# EAGLE board EPS (EAGLE 9.5.1), part 1 of 3
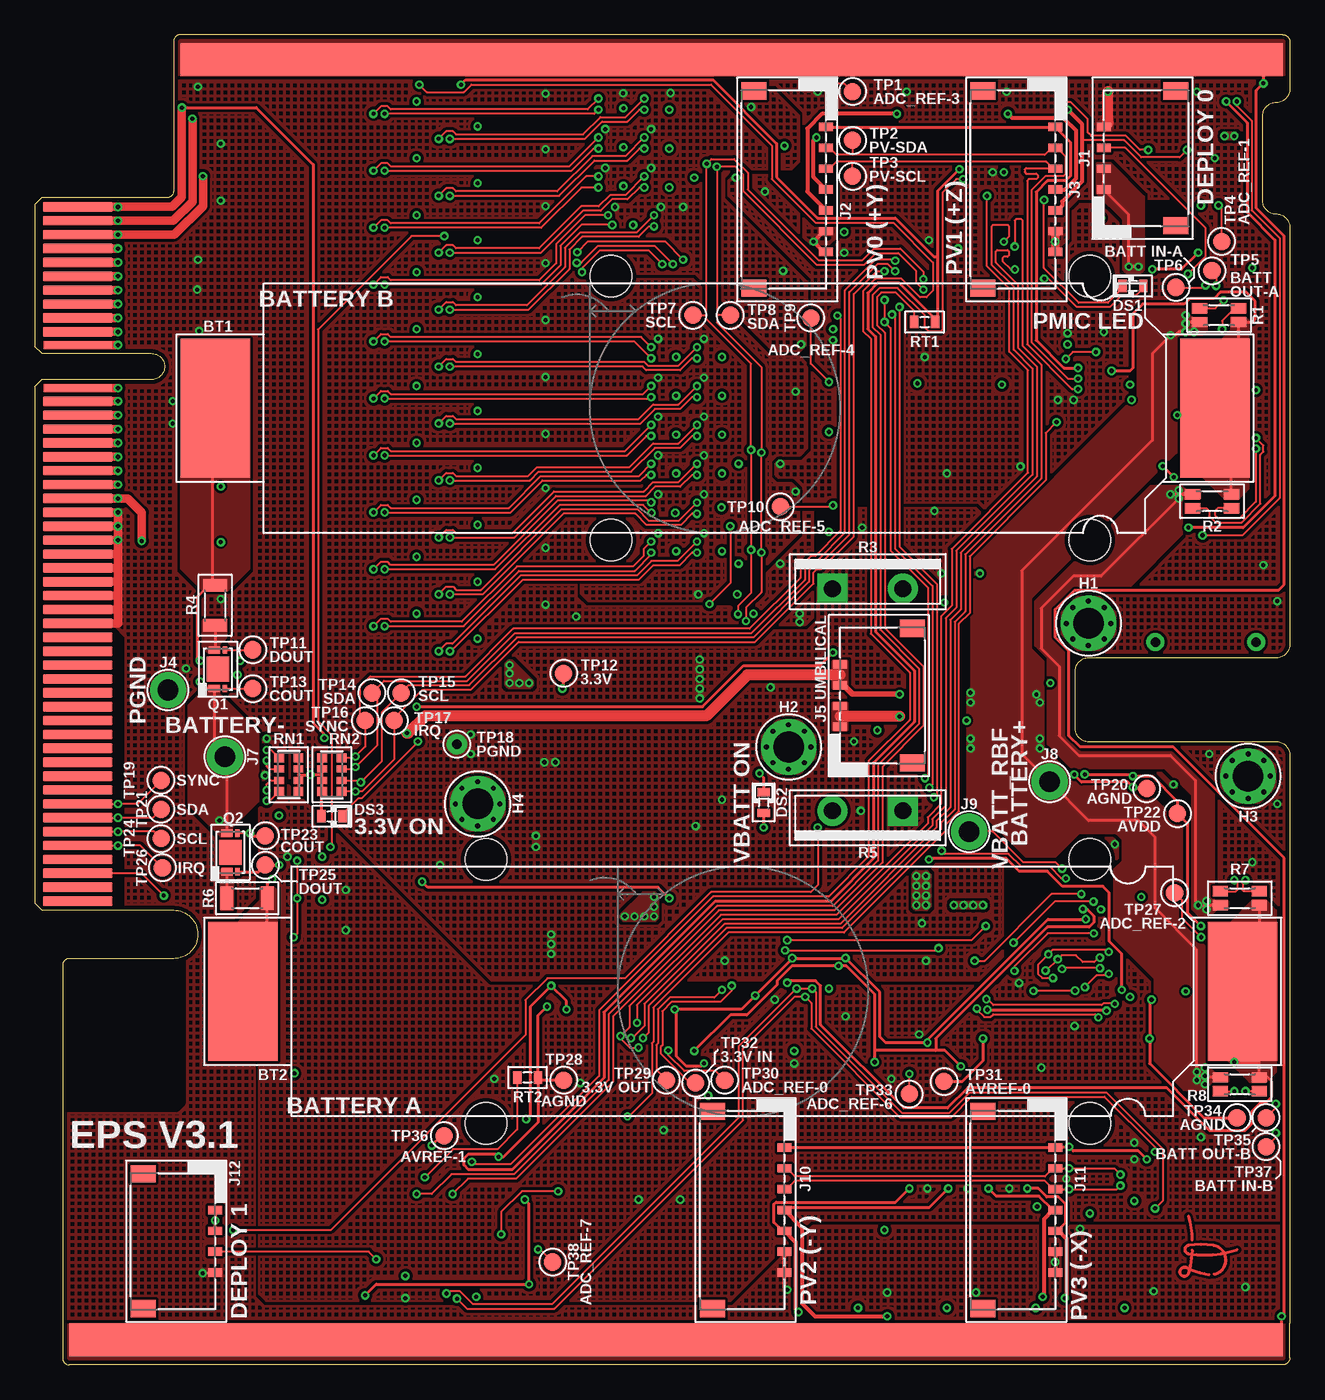
[diagram p13: board, top side]
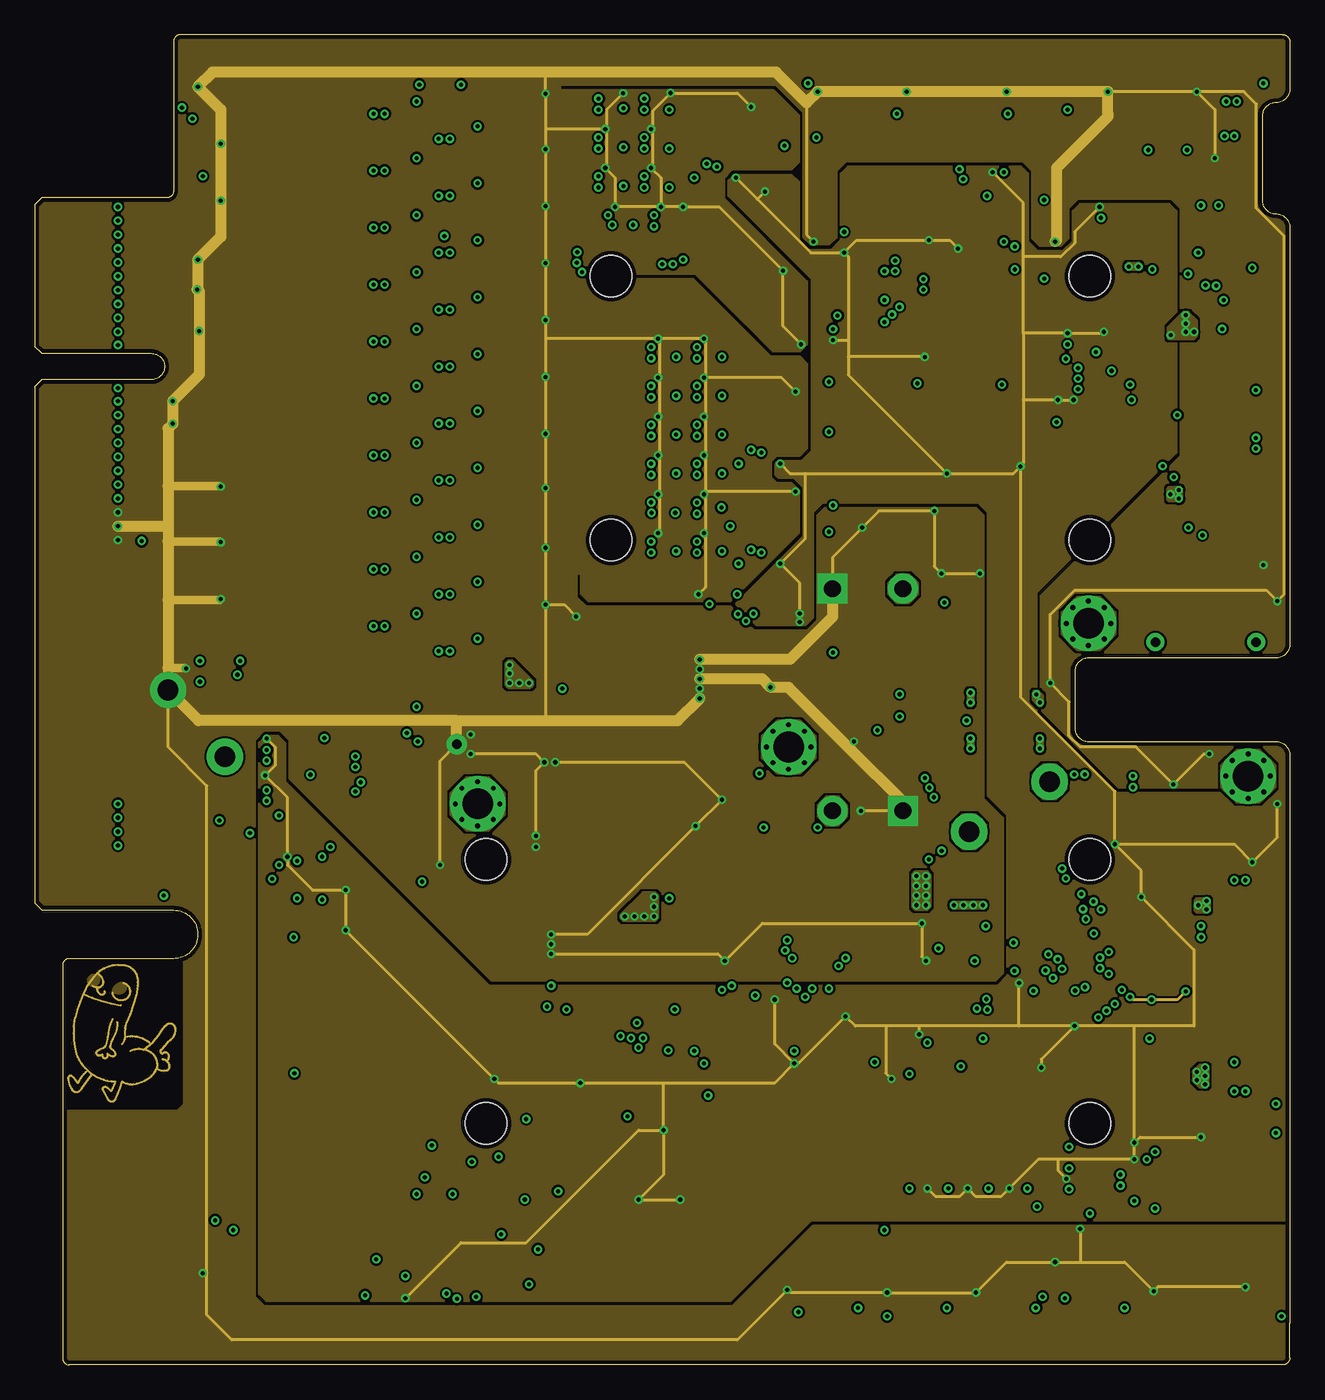
[diagram p14: board, inner layer Route2]
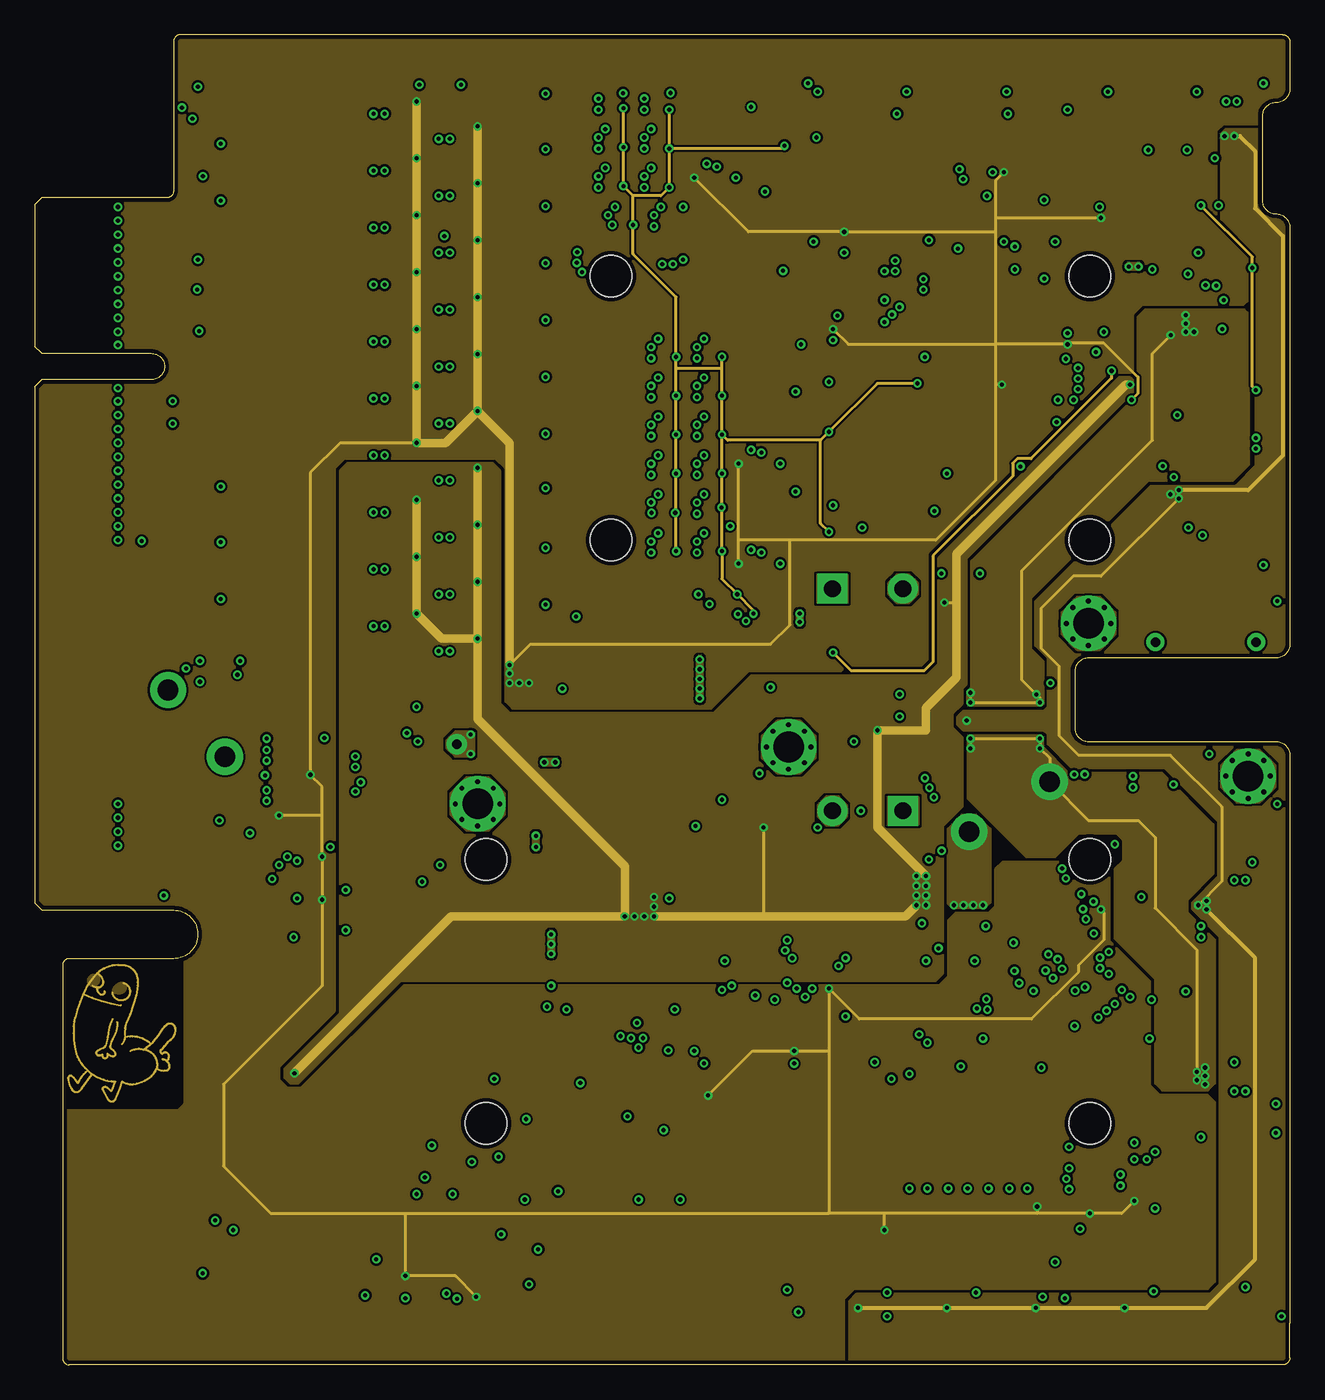
[diagram p15: board, inner layer Route15]
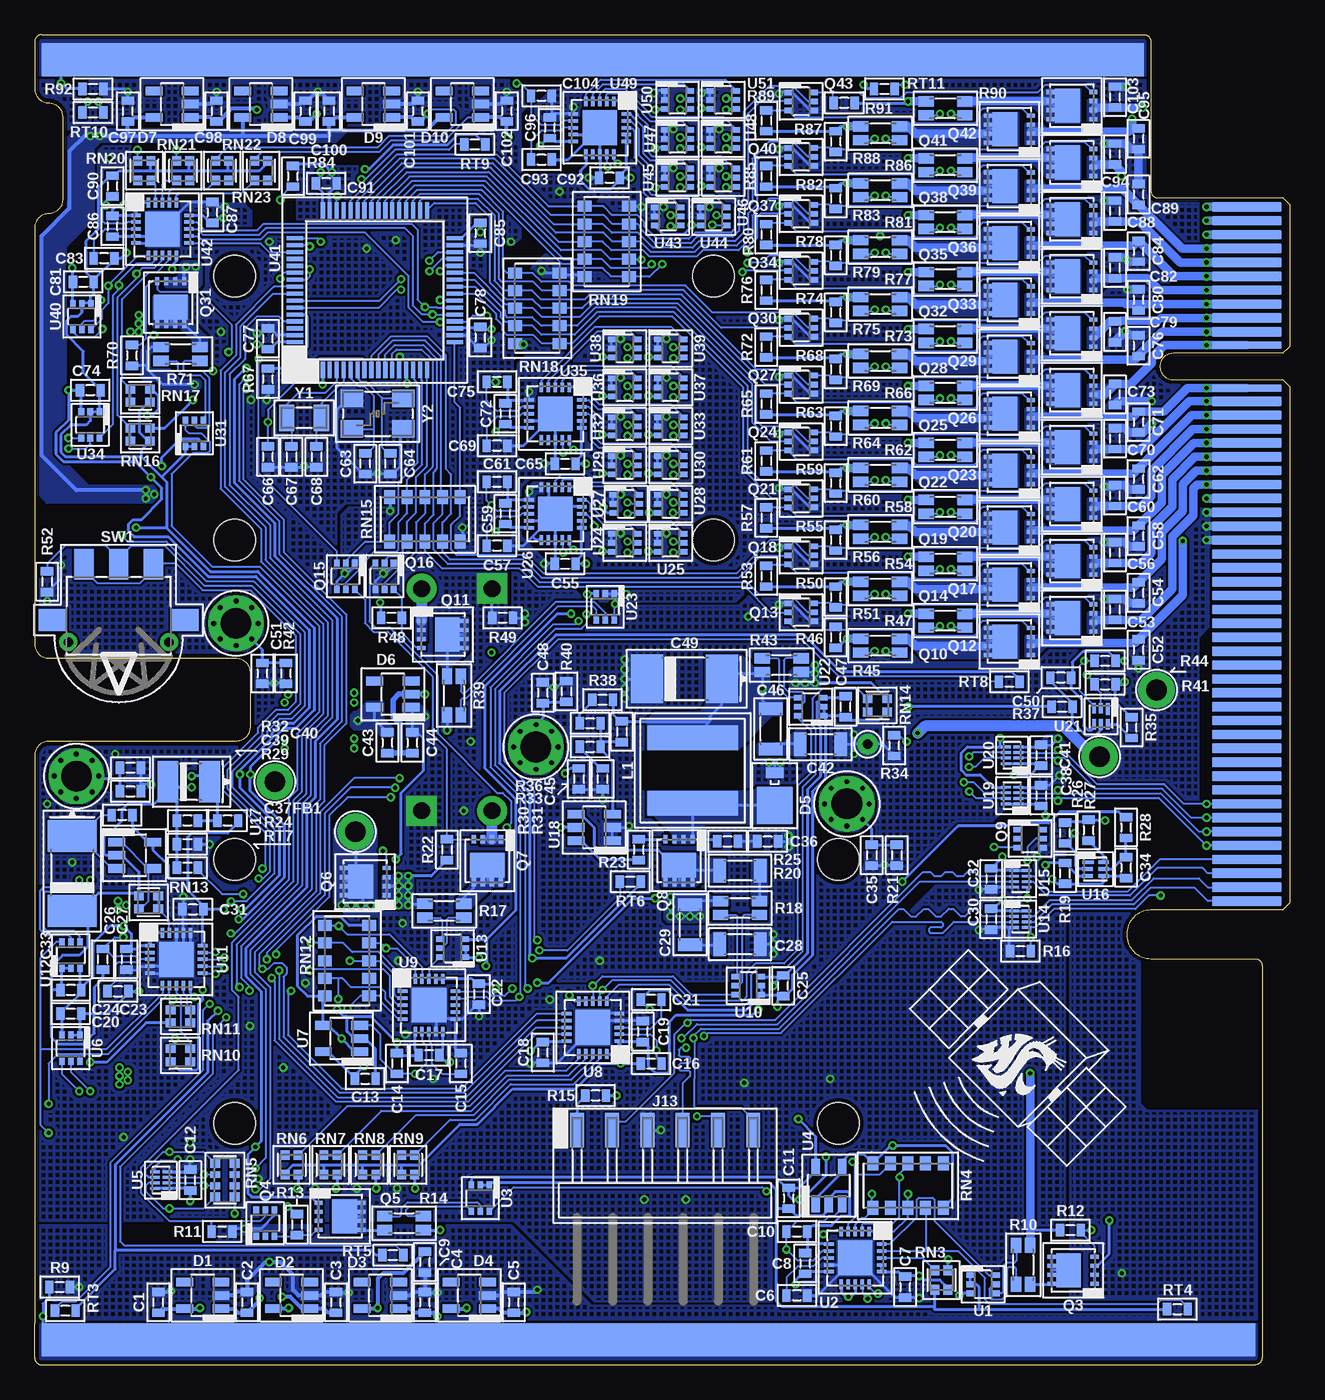
[diagram p16: board, bottom side, seen from below]

Size 90.4 x 95.8 mm. Coordinates in mm from the lower left corner, seen from the top.
Outline: 90.4,92.8 90.4,91.9 arc-90 89.4,90.9 arc90 88.4,89.9 88.4,83.9 arc90 89.4,82.9 arc-90 90.4,81.9 90.4,51.9 arc-90 89.4,50.9 75.9,50.9 arc90 74.9,49.9 74.9,45.9 arc90 75.9,44.9 89.4,44.9 arc-90 90.4,43.9 90.4,3
Copper layers (1+2*15+16): Top 0.035mm / dielectric 0.2mm / Route2 0.017mm / dielectric 1.1mm / Route15 0.017mm / dielectric 0.2mm / Bottom 0.035mm
Design rules "CougsInSpace *": minimum track width 0.16mm, minimum drill 0.3mm, track to track 0.16mm, track to pad 0.16mm, pad to pad 0.16mm, via to via 0.16mm, smd to smd 0mil, copper to edge 0.3mm, drill to drill 0.3mm, minimum pad ring 0.15mm, minimum via ring 0.15mm, stop-mask expansion 0mil, vias tented up to drill 1mm, thermal gap 0.25mm
Net classes: 1 power: width 0.2 mm
Holes 3 mm at 41.5,78.4 76,78.4 76,59.4 41.5,59.4 76,36.4 32.5,36.4 32.5,17.4 76,17.4
tKeepout: area 74.5,59.4 to 77.5,63.6; area 74.5,74.2 to 77.5,78.4; area 40,59.4 to 43,63.6; area 40,74.2 to 43,78.4; area 74.5,32.2 to 77.5,36.4; area 74.5,17.4 to 77.5,21.6; area 31,32.2 to 34,36.4; area 31,17.4 to 34,21.6; area 54.8,54.8 to 65.2,63.6; area 54.8,32.2 to 65.2,41
bKeepout: area 74.5,59.4 to 77.5,75.4; area 73.5,75.4 to 78.5,80.4; area 40,59.4 to 43,75.4; area 39,75.4 to 44,80.4; area 74.5,20.4 to 77.5,36.4; area 73.5,15.4 to 78.5,20.4; area 31,20.4 to 34,36.4; area 30,15.4 to 35,20.4; area 75.4,43.9 to 90.4,51.9
tRestrict: area 2,18.5 to 10.6,29.5
bRestrict: area 2,18.5 to 10.6,29.5

## Footprints (pad centres in the part's own frame; a part is rotated, then mirrored left to right if it is on the bottom)
18650-SOLDERED = smd 5 x 10: A -36,0; C 36,0
1608 = smd 0.6 x 0.9: 1 -0.75,0; 2 0.75,0
3216 = smd 0.9 x 1.7: 1 -1.45,0; 2 1.45,0
7132-POL = smd 2.3 x 3.5: A 2.7,0; C -2.7,0
4028-POL = smd 1.5 x 3: A 1.5,0; C -1.5,0
SOT23-5 = smd 1.22 x 0.62: 1 -1.31,0.95; 2 -1.31,0; 3 -1.31,-0.95; 4 1.31,-0.95; 5 1.31,0.95
POWERMITE = smd 0.76 x 1.27: A 2.349,0 | smd 2.67 x 2.54: C 0,0
1608-POL = smd 0.6 x 0.9: A 0.75,0; C -0.75,0
MOUNTING_HOLE-2.2 = drill 2.2 pad 4: 1 0,0 | drill 0.35 pad 0.6: V1 1.6,0; V2 1.131,1.131; V3 0,1.6; V4 -1.131,1.131; V5 -1.6,0; V6 -1.131,-1.131; V7 0,-1.6; V8 1.131,-1.131
PICOLOCK1.5-04 = smd 0.6 x 1: 1 2.25,0; 2 0.75,0; 3 -0.75,0; 4 -2.25,0 | smd 1.25 x 1.8: PAD@1 4.855,5.2; PAD@2 -4.855,5.2
PICOLOCK1.5-07 = smd 0.6 x 1: 1 4.5,0; 2 3,0; 3 1.5,0; 4 0,0; 5 -1.5,0; 6 -3,0; 7 -4.5,0 | smd 1.25 x 1.8: PAD@1 7.105,5.2; PAD@2 -7.105,5.2
THT-1.5 = drill 1.5 pad 2.5: 1 0,0
CARD-FULL-OPEN+X = smd 5 x 0.7 bottom: A1 3.1,35.5; A2 3.1,34.5; A3 3.1,33.5; A4 3.1,32.5; A5 3.1,31.5; A6 3.1,30.5; A7 3.1,29.5; A8 3.1,28.5; A9 3.1,27.5; A10 3.1,26.5; A13 3.1,21.5; A14 3.1,20.5; A15 3.1,19.5; A16 3.1,18.5; A17 3.1,17.5; A18 3.1,16.5; A19 3.1,15.5; A20 3.1,14.5; A21 3.1,13.5; A22 3.1,12.5; A23 3.1,11.5; A24 3.1,10.5; A25 3.1,9.5; A26 3.1,8.5; A27 3.1,7.5; A28 3.1,6.5; A29 3.1,5.5; A30 3.1,4.5; A31 3.1,3.5; A32 3.1,2.5; A33 3.1,1.5; A34 3.1,0.5; A35 3.1,-0.5; A36 3.1,-1.5; A37 3.1,-2.5; A38 3.1,-3.5; A39 3.1,-4.5; A40 3.1,-5.5; A41 3.1,-6.5; A42 3.1,-7.5; A43 3.1,-8.5; A44 3.1,-9.5; A45 3.1,-10.5; A46 3.1,-11.5; A47 3.1,-12.5; A48 3.1,-13.5; A49 3.1,-14.5 | smd 5 x 0.6 bottom: A11 3.1,25.55; A12 3.1,22.45 | smd 5 x 0.7: B1 3.1,35.5; B2 3.1,34.5; B3 3.1,33.5; B4 3.1,32.5; B5 3.1,31.5; B6 3.1,30.5; B7 3.1,29.5; B8 3.1,28.5; B9 3.1,27.5; B10 3.1,26.5; B13 3.1,21.5; B14 3.1,20.5; B15 3.1,19.5; B16 3.1,18.5; B17 3.1,17.5; B18 3.1,16.5; B19 3.1,15.5; B20 3.1,14.5; B21 3.1,13.5; B22 3.1,12.5; B23 3.1,11.5; B24 3.1,10.5; B25 3.1,9.5; B26 3.1,8.5; B27 3.1,7.5; B28 3.1,6.5; B29 3.1,5.5; B30 3.1,4.5; B31 3.1,3.5; B32 3.1,2.5; B33 3.1,1.5; B34 3.1,0.5; B35 3.1,-0.5; B36 3.1,-1.5; B37 3.1,-2.5; B38 3.1,-3.5; B39 3.1,-4.5; B40 3.1,-5.5; B41 3.1,-6.5; B42 3.1,-7.5; B43 3.1,-8.5; B44 3.1,-9.5; B45 3.1,-10.5; B46 3.1,-11.5; B47 3.1,-12.5; B48 3.1,-13.5; B49 3.1,-14.5 | smd 5 x 0.6: B11 3.1,25.55; B12 3.1,22.45 | smd 79.4 x 2.4 bottom: CHASSIS@1 50.2,46.1 | smd 79.4 x 2.4: CHASSIS@2 50.2,46.1 | smd 87.4 x 2.4 bottom: CHASSIS@3 46.2,-46.1 | smd 87.4 x 2.4: CHASSIS@4 46.2,-46.1
SMD2.54-1X06-R = smd 1 x 2.5: 1 6.35,-5; 2 3.81,-5; 3 1.27,-5; 4 -1.27,-5; 5 -3.81,-5; 6 -6.35,-5
7575 = smd 1.78 x 6.5: 1 -2.36,0; 2 2.36,0
UDFN-6-B = smd 0.53 x 0.84: 1 -1.385,0.255; 6 1.385,0.255 | smd 0.53 x 0.35: 3 -1.385,-0.5; 4 1.385,-0.5 | smd 1.8 x 1.6: PAD 0,0
SON-3333 = smd 0.6 x 0.3: 1 -1.55,0.975; 2 -1.55,0.325; 3 -1.55,-0.325; 4 -1.55,-0.975; 5 1.55,-0.975; 6 1.55,-0.325; 7 1.55,0.325; 8 1.55,0.975 | smd 1.775 x 2.45: PAD 0.325,0
SOT363 = smd 0.5 x 0.4: 1 -0.95,0.65; 2 -0.95,0; 3 -0.95,-0.65; 4 0.95,-0.65; 5 0.95,0; 6 0.95,0.65
3216-KELVIN = smd 1.1 x 0.75: 1 -1.4,-0.5; 1-KELVIN -1.4,0.5; 2 1.4,-0.5; 2-KELVIN 1.4,0.5
TO-220-2 = drill 1.2 square: 1 -2.54,0 | drill 1.2: 3 2.54,0
1632 = smd 0.64 x 0.7: 1 -1.2,-0.7; 4 1.2,-0.7; 5 1.2,0.7; 8 -1.2,0.7 | smd 0.5 x 0.7: 2 -0.4,-0.7; 3 0.4,-0.7; 6 0.4,0.7; 7 -0.4,0.7
1616 = smd 0.64 x 0.7: 1 -0.47,-0.7; 2 0.47,-0.7; 3 0.47,0.7; 4 -0.47,0.7
3264 = smd 0.79 x 1: 1 -2.54,-1.6; 2 -1.27,-1.6; 3 0,-1.6; 4 1.27,-1.6; 5 2.54,-1.6; 6 2.54,1.6; 7 1.27,1.6; 8 0,1.6; 9 -1.27,1.6; 10 -2.54,1.6
ESE24MH1 = smd 1.4 x 2.2: 1 -2.5,-5.6; 2 2.5,-5.6; C 0,-5.6 | smd 2 x 1.6: SHIELD@1 -4.75,-1.6; SHIELD@4 4.75,-1.6 | drill 0.7 pad 1.3: SHIELD@2 -3.625,0; SHIELD@3 3.625,0
SMD-C-1.25 = smd 1.25 x 1.25: 1 0,0
THT-0.7 = drill 0.7 pad 1.5: 1 0,0
QFN-20-4040 = smd 0.7 x 0.25: 1 -1.9,1; 2 -1.9,0.5; 3 -1.9,0; 4 -1.9,-0.5; 5 -1.9,-1; 11 1.9,-1; 12 1.9,-0.5; 13 1.9,0; 14 1.9,0.5; 15 1.9,1 | smd 0.25 x 0.7: 6 -1,-1.9; 7 -0.5,-1.9; 8 0,-1.9; 9 0.5,-1.9; 10 1,-1.9; 16 1,1.9; 17 0.5,1.9; 18 0,1.9; 19 -0.5,1.9; 20 -1,1.9 | smd 2.5 x 2.5: PAD 0,0
X2SON-8 = smd 0.2 x 0.7: 1 0.6,0.45; 2 0.2,0.45; 3 -0.2,0.45; 4 -0.6,0.45; 5 -0.6,-0.45; 6 -0.2,-0.45; 7 0.2,-0.45; 8 0.6,-0.45
WSON-6 = smd 0.85 x 0.28: 1 -0.525,0.5 | smd 0.75 x 0.28: 2 -0.575,0; 3 -0.575,-0.5; 4 0.575,-0.5; 5 0.575,0; 6 0.575,0.5
SOT23-6 = smd 1.22 x 0.62: 1 -1.31,0.95; 2 -1.31,0; 3 -1.31,-0.95; 4 1.31,-0.95; 5 1.31,0; 6 1.31,0.95
QFP-64-1010 = smd 1.2 x 0.3: 1 -5.75,3.75; 2 -5.75,3.25; 3 -5.75,2.75; 4 -5.75,2.25; 5 -5.75,1.75; 6 -5.75,1.25; 7 -5.75,0.75; 8 -5.75,0.25; 9 -5.75,-0.25; 10 -5.75,-0.75; 11 -5.75,-1.25; 12 -5.75,-1.75; 13 -5.75,-2.25; 14 -5.75,-2.75; 15 -5.75,-3.25; 16 -5.75,-3.75; 33 5.75,-3.75; 34 5.75,-3.25; 35 5.75,-2.75; 36 5.75,-2.25; 37 5.75,-1.75; 38 5.75,-1.25; 39 5.75,-0.75; 40 5.75,-0.25; 41 5.75,0.25; 42 5.75,0.75; 43 5.75,1.25; 44 5.75,1.75; 45 5.75,2.25; 46 5.75,2.75; 47 5.75,3.25; 48 5.75,3.75 | smd 0.3 x 1.2: 17 -3.75,-5.75; 18 -3.25,-5.75; 19 -2.75,-5.75; 20 -2.25,-5.75; 21 -1.75,-5.75; 22 -1.25,-5.75; 23 -0.75,-5.75; 24 -0.25,-5.75; 25 0.25,-5.75; 26 0.75,-5.75; 27 1.25,-5.75; 28 1.75,-5.75; 29 2.25,-5.75; 30 2.75,-5.75; 31 3.25,-5.75; 32 3.75,-5.75; 49 3.75,5.75; 50 3.25,5.75; 51 2.75,5.75; 52 2.25,5.75; 53 1.75,5.75; 54 1.25,5.75; 55 0.75,5.75; 56 0.25,5.75; 57 -0.25,5.75; 58 -0.75,5.75; 59 -1.25,5.75; 60 -1.75,5.75; 61 -2.25,5.75; 62 -2.75,5.75; 63 -3.25,5.75; 64 -3.75,5.75
SMD-3215 = smd 1.1 x 1.9: 1 -1.25,0; 2 1.25,0
SMD-5032 = smd 1.6 x 1.25: 1 -1.85,-1.1; 2 1.85,-1.1; 3 1.85,1.1; 4 -1.85,1.1

## Placement (x,y rotation side)
BT1  Li-Ion  [18650-SOLDERED]  49,68.9 0 top
BT2  Li-Ion  [18650-SOLDERED]  51,26.9 0 top
C1  1µF 10%  [1608]  81.5,4.5 90 bottom
C2  1µF 10%  [1608]  75.1,4.5 90 bottom
C3  1µF 10%  [1608]  68.7,4.5 90 bottom
C4  1µF 10%  [1608]  62.3,4.5 90 bottom
C5  1µF 10%  [1608]  55.9,4.5 90 bottom
C6  1µF 10%  [1608]  35.5,5 0 bottom
C7  100nF 10%  [1608]  27.7,5.6 270 bottom
C8  100nF 10%  [1608]  34.9,7.3 90 bottom
C9  1µF 10%  [1608]  62.3,7.4 270 bottom
C10  10µF 10%  [1608]  35.5,9.6 0 bottom
C11  100nF 10%  [1608]  36.1,12 270 bottom
C12  100nF 10%  [1608]  79.2,13.3 90 bottom
C13  100nF 10%  [1608]  66.6,20.6 0 bottom
C14  10µF 10%  [1608]  64.3,21.7 90 bottom
C15  1µF 10%  [1608]  59.7,21.7 90 bottom
C16  10µF 10%  [1608]  46,21.7 180 bottom
C17  100nF 10%  [1608]  62,22.3 180 bottom
C18  100nF 10%  [1608]  53.8,22.5 270 bottom
C19  100nF 10%  [1608]  46.6,24 90 bottom
C20  100nF 10%  [1608]  87.8,25.3 0 bottom
C21  100nF 10%  [1608]  46,26.3 180 bottom
C22  100nF 10%  [1608]  58.4,26.7 270 bottom
C23  100nF 10%  [1608]  84.4,26.9 0 bottom
C24  100nF 10%  [1608]  87.8,27 180 bottom
C25  100nF 10%  [1608]  36.5,27.3 270 bottom
C26  10µF 10%  [1608]  85.5,29.2 270 bottom
C27  100nF 10%  [1608]  83.8,29.2 270 bottom
C28  10µF 10%  [3216]  39.6,30.3 0 bottom
C29  10µF 10%  [3216]  43.2,31.7 270 bottom
C30  100nF 10%  [1608]  21.5,32.1 270 bottom
C31  100nF 10%  [1608]  79,32.8 180 bottom
C32  100nF 10%  [1608]  21.5,35 270 bottom
C33  220µF 10%  [7132-POL]  87.7,35.4 90 bottom
C34  100nF 10%  [1608]  11.8,35.8 270 bottom
C35  100nF 10%  [1608]  30.1,36.7 270 bottom
C36  470pF 1%  [1608]  37.6,37.7 0 bottom
C37  100nF 10%  [1608]  79.4,39.2 180 bottom
C38  100nF 10%  [1608]  17.9,41 90 bottom
C39  100nF 10%  [1608]  83.5,41.3 0 bottom
C40  4.7µF 10%  [4028-POL]  79.3,42 0 bottom
C41  100nF 10%  [1608]  17.9,43.9 90 bottom
C42  10µF 10%  [3216]  33.8,44.7 0 bottom
C43  1µF 10%  [1608]  65,44.8 270 bottom
C44  1µF 10%  [1608]  63.2,44.8 270 bottom
C45  4.7pF ±0.1  [1608]  48.1,45.6 270 bottom
C46  10µF 10%  [3216]  37.4,45.8 270 bottom
C47  100nF 10%  [1608]  32,47.4 270 bottom
C48  100nF 10%  [1608]  53.8,48.4 90 bottom
C49  220µF 10%  [7132-POL]  43.6,49.4 0 bottom
C50  100nF 10%  [1608]  16.5,49.5 0 bottom
C51  100nF 10%  [1608]  74,49.8 270 bottom
C52  10µF 10%  [1608]  10.9,51.5 270 bottom
C53  10µF 10%  [1608]  12.6,54.4 90 bottom
C54  10µF 10%  [1608]  10.9,55.6 270 bottom
C55  100nF 10%  [1608]  52.2,57.7 180 bottom
C56  10µF 10%  [1608]  12.6,58.5 90 bottom
C57  1µF 10%  [1608]  57.1,59 0 bottom
C58  10µF 10%  [1608]  10.9,59.7 270 bottom
C59  100nF 10%  [1608]  56.5,61.3 90 bottom
C60  10µF 10%  [1608]  12.6,62.6 90 bottom
C61  10µF 10%  [1608]  57.1,63.6 0 bottom
C62  10µF 10%  [1608]  10.9,63.8 270 bottom
C63  8pF ±0.25  [1608]  66.6,64.9 270 bottom
C64  8pF ±0.25  [1608]  64.8,64.9 270 bottom
C65  100nF 10%  [1608]  52.2,64.9 180 bottom
C66  10nF 10%  [1608]  73.6,65.4 270 bottom
C67  15pF 1%  [1608]  71.9,65.4 270 bottom
C68  15pF 1%  [1608]  70.1,65.4 270 bottom
C69  1µF 10%  [1608]  57.1,66.2 0 bottom
C70  10µF 10%  [1608]  12.6,66.7 90 bottom
C71  10µF 10%  [1608]  10.9,67.9 270 bottom
C72  100nF 10%  [1608]  56.5,68.5 90 bottom
C73  10µF 10%  [1608]  12.6,69.9 270 bottom
C74  100nF 10%  [1608]  86.4,70.2 0 bottom
C75  10µF 10%  [1608]  57.1,70.8 0 bottom
C76  10µF 10%  [1608]  10.9,73.4 270 bottom
C77  100nF 10%  [1608]  73.6,73.9 90 bottom
C78  100nF 10%  [1608]  58.3,74 270 bottom
C79  10µF 10%  [1608]  12.6,74.4 90 bottom
C80  10µF 10%  [1608]  10.9,76.7 270 bottom
C81  100nF 10%  [1608]  86.9,78 0 bottom
C82  10µF 10%  [1608]  12.6,79 270 bottom
C83  100nF 10%  [1608]  85.4,79.7 0 bottom
C84  10µF 10%  [1608]  10.9,80.2 90 bottom
C85  100nF 10%  [1608]  58.3,81.5 270 bottom
C86  100nF 10%  [1608]  84.8,82 270 bottom
C87  100nF 10%  [1608]  77.6,83 90 bottom
C88  10µF 10%  [1608]  12.6,83.1 270 bottom
C89  10µF 10%  [1608]  10.9,84.3 270 bottom
C90  10µF 10%  [1608]  84.8,84.9 90 bottom
C91  100nF 10%  [1608]  69.4,85.1 0 bottom
C92  100nF 10%  [1608]  49,85.5 180 bottom
C93  1µF 10%  [1608]  53.9,86.8 0 bottom
C94  10µF 10%  [1608]  12.6,87.2 270 bottom
C95  10µF 10%  [1608]  10.9,88.3 90 bottom
C96  100nF 10%  [1608]  53.3,89.1 90 bottom
C97  1µF 10%  [1608]  83.7,90.3 90 bottom
C98  1µF 10%  [1608]  77.3,90.3 90 bottom
C99  1µF 10%  [1608]  70.9,90.3 90 bottom
C100  1µF 10%  [1608]  69.2,90.3 90 bottom
C101  1µF 10%  [1608]  62.8,90.3 90 bottom
C102  1µF 10%  [1608]  56.4,90.3 90 bottom
C103  10µF 10%  [1608]  12.6,91.3 270 bottom
C104  10µF 10%  [1608]  53.9,91.4 0 bottom
D1  MAX40200  [SOT23-5]  78.3,5 180 bottom
D2  MAX40200  [SOT23-5]  71.9,5 180 bottom
D3  MAX40200  [SOT23-5]  65.5,5 180 bottom
D4  MAX40200  [SOT23-5]  59.1,5 180 bottom
D5  MBRM120LT  [POWERMITE]  37.1,40.3 90 bottom
D6  MAX40200  [SOT23-5]  64.6,48.3 180 bottom
D7  MAX40200  [SOT23-5]  80.5,90.8 180 bottom
D8  MAX40200  [SOT23-5]  74.1,90.8 180 bottom
D9  MAX40200  [SOT23-5]  66,90.8 180 bottom
D10  MAX40200  [SOT23-5]  59.6,90.8 180 bottom
DS1  Blue  [1608-POL]  79.1,77.7 0 top
DS2  Green  [1608-POL]  52.5,40.5 270 top
DS3  Yellow  [1608-POL]  21.4,39.5 180 top
FB1  1.5kΩ @ 100MHz  [1608]  76.5,39.2 180 bottom
H1  M2  [MOUNTING_HOLE-2.2]  75.9,53.4 0 top
H2  M2  [MOUNTING_HOLE-2.2]  54.3,44.5 0 top
H3  M2  [MOUNTING_HOLE-2.2]  87.4,42.4 0 top
H4  M2  [MOUNTING_HOLE-2.2]  31.9,40.4 0 top
J1  Deployable 0  [PICOLOCK1.5-04]  77,86.9 270 top
J2  PV0  [PICOLOCK1.5-07]  57,84.65 90 top
J3  PV1  [PICOLOCK1.5-07]  73.5,84.65 90 top
J4  PGND  [THT-1.5]  9.6,48.6 0 top
J5  Umbilical  [PICOLOCK1.5-04]  58,48.2 270 top
J6  CougSat Card  [CARD-FULL-OPEN+X]  0,47.9 0 top
J7  Battery -  [THT-1.5]  13.7,43.8 0 top
J8  Battery +  [THT-1.5]  73.1,42 0 top
J9  VBatt  [THT-1.5]  67.3,38.4 0 top
J10  PV2  [PICOLOCK1.5-07]  54,11.15 90 top
J11  PV3  [PICOLOCK1.5-07]  73.5,11.15 90 top
J12  Deployable 1  [PICOLOCK1.5-04]  13,8.9 90 top
J13  SWD  [SMD2.54-1X06-R]  45,11.9 180 bottom
L1  4.7µH 20%  [7575]  43,42.8 90 bottom
LOGO1  SIGNATUREBRADLEY  [SIGN-BRADLEY]  84.6,8.5 0 top
LOGO2  Satellite 16mm  [CIS-SATELLITE-16]  19.6,22.1 0 bottom
Q1  DMN2008LFU  [UDFN-6-B]  13.2,50.1 90 top
Q2  DMN2008LFU  [UDFN-6-B]  14.1,36.9 90 top
Q3  CSD25402Q3A  [SON-3333]  15.6,6.8 180 bottom
Q4  DMN53D0LDW  [SOT363]  73.8,10.2 90 bottom
Q5  CSD25402Q3A  [SON-3333]  68.4,10.7 0 bottom
Q6  CSD25402Q3A  [SON-3333]  66.6,34.8 180 bottom
Q7  CSD25402Q3A  [SON-3333]  57.8,36.3 270 bottom
Q8  CSD25402Q3A  [SON-3333]  44,36.3 270 bottom
Q9  DMN53D0LDW  [SOT363]  18.7,37.9 0 bottom
Q10  CSD25402Q3A  [SON-3333]  20.2,52.1 180 bottom
Q11  CSD25402Q3A  [SON-3333]  61,52.6 0 bottom
Q12  CSD25402Q3A  [SON-3333]  15.7,53.8 180 bottom
Q13  DMN53D0LDW  [SOT363]  35.2,54.2 0 bottom
Q14  CSD25402Q3A  [SON-3333]  20.2,56.2 180 bottom
Q15  DMN53D0LDW  [SOT363]  68,56.8 270 bottom
Q16  DMN53D0LDW  [SOT363]  65.2,56.8 270 bottom
Q17  CSD25402Q3A  [SON-3333]  15.7,57.9 180 bottom
Q18  DMN53D0LDW  [SOT363]  35.2,58.3 0 bottom
Q19  CSD25402Q3A  [SON-3333]  20.2,60.3 180 bottom
Q20  CSD25402Q3A  [SON-3333]  15.7,62 180 bottom
Q21  DMN53D0LDW  [SOT363]  35.2,62.4 0 bottom
Q22  CSD25402Q3A  [SON-3333]  20.2,64.4 180 bottom
Q23  CSD25402Q3A  [SON-3333]  15.7,66.1 180 bottom
Q24  DMN53D0LDW  [SOT363]  35.2,66.5 0 bottom
Q25  CSD25402Q3A  [SON-3333]  20.2,68.5 180 bottom
Q26  CSD25402Q3A  [SON-3333]  15.7,70.2 180 bottom
Q27  DMN53D0LDW  [SOT363]  35.2,70.6 0 bottom
Q28  CSD25402Q3A  [SON-3333]  20.2,72.6 180 bottom
Q29  CSD25402Q3A  [SON-3333]  15.7,74.3 180 bottom
Q30  DMN53D0LDW  [SOT363]  35.2,74.7 0 bottom
Q31  CSD25402Q3A  [SON-3333]  80.6,76.5 270 bottom
Q32  CSD25402Q3A  [SON-3333]  20.2,76.7 180 bottom
Q33  CSD25402Q3A  [SON-3333]  15.7,78.4 180 bottom
Q34  DMN53D0LDW  [SOT363]  35.2,78.8 0 bottom
Q35  CSD25402Q3A  [SON-3333]  20.2,80.8 180 bottom
Q36  CSD25402Q3A  [SON-3333]  15.7,82.5 180 bottom
Q37  DMN53D0LDW  [SOT363]  35.2,82.9 0 bottom
Q38  CSD25402Q3A  [SON-3333]  20.2,84.9 180 bottom
Q39  CSD25402Q3A  [SON-3333]  15.7,86.6 180 bottom
Q40  DMN53D0LDW  [SOT363]  35.2,87 0 bottom
Q41  CSD25402Q3A  [SON-3333]  20.2,89 180 bottom
Q42  CSD25402Q3A  [SON-3333]  15.7,90.7 180 bottom
Q43  DMN53D0LDW  [SOT363]  35.2,91 0 bottom
R1  12mΩ 1%  [3216-KELVIN]  85.3,75.6 0 top
R2  12mΩ 1%  [3216-KELVIN]  84.8,62.2 180 top
R3  10Ω 5%  [TO-220-2]  60,55.9 0 top
R4  10mΩ 1%  [3216]  13,54.7 90 top
R5  10Ω 5%  [TO-220-2]  60,39.9 180 top
R6  10mΩ 1%  [3216]  15.3,33.6 0 top
R7  12mΩ 1%  [3216-KELVIN]  86.8,33.6 0 top
R8  12mΩ 1%  [3216-KELVIN]  86.8,20.2 180 top
R9  0Ω <20mΩ  [1608]  88.6,5.6 180 bottom
R10  12mΩ 1%  [3216-KELVIN]  19.2,7.2 90 bottom
R11  10kΩ 0.1%  [1608]  76.9,9.6 0 bottom
R12  10kΩ 0.1%  [1608]  15.8,9.7 180 bottom
R13  10kΩ 0.1%  [1608]  71.5,10.1 90 bottom
R14  12mΩ 1%  [3216-KELVIN]  63.8,10.2 0 bottom
R15  1kΩ 0.1%  [1608]  50,19.4 0 bottom
R16  10kΩ 0.1%  [1608]  19.4,29.8 0 bottom
R17  12mΩ 1%  [3216-KELVIN]  60.9,32.7 180 bottom
R18  12mΩ 1%  [3216-KELVIN]  39.6,32.9 180 bottom
R19  4.75MΩ 1%  [1608]  16.2,35.4 90 bottom
R20  10mΩ 1%  [3216]  39.6,35.6 0 bottom
R21  0Ω <20mΩ  [1608]  28.3,36.7 90 bottom
R22  10kΩ 0.1%  [1608]  60.7,37.1 270 bottom
R23  0Ω <20mΩ  [1608]  46.9,37.1 90 bottom
R24  0Ω <20mΩ  [1608]  79.4,37.5 0 bottom
R25  150Ω 1%  [1608]  40.5,37.7 180 bottom
R26  4.75MΩ 1%  [1608]  16.2,38.3 270 bottom
R27  2.2kΩ 1%  [1608]  14.5,38.5 270 bottom
R28  330Ω 1%  [1608]  11.8,38.7 90 bottom
R29  158kΩ 0.1%  [1608]  84.1,39.6 0 bottom
R30  1kΩ 0.1%  [1608]  51.2,42.2 90 bottom
R31  360kΩ 1%  [1608]  49.5,42.2 90 bottom
R32  0Ω <20mΩ  [1608]  83.5,43 180 bottom
R33  0Ω <20mΩ  [1608]  50.4,44.5 0 bottom
R34  1kΩ 0.1%  [1608]  28.5,44.6 90 bottom
R35  2.2kΩ 1%  [1608]  11.4,45.9 270 bottom
R36  620kΩ 1%  [1608]  50.4,46.2 180 bottom
R37  330Ω 1%  [1608]  16.4,47.4 180 bottom
R38  0Ω <20mΩ  [1608]  49.5,47.9 0 bottom
R39  12mΩ 1%  [3216-KELVIN]  60.2,48.2 270 bottom
R40  0Ω <20mΩ  [1608]  52.1,48.5 270 bottom
R41  4.75MΩ 1%  [1608]  13.3,49 180 bottom
R42  0Ω <20mΩ  [1608]  72.3,49.8 90 bottom
R43  12mΩ 1%  [3216-KELVIN]  36.6,50.4 0 bottom
R44  4.75MΩ 1%  [1608]  13.3,50.7 0 bottom
R45  12mΩ 1%  [3216-KELVIN]  29.5,51.8 180 bottom
R46  10kΩ 0.1%  [1608]  32.7,52.4 270 bottom
R47  12mΩ 1%  [3216-KELVIN]  24.8,53.6 180 bottom
R48  10kΩ 0.1%  [1608]  64.7,53.8 180 bottom
R49  0Ω <20mΩ  [1608]  56.7,53.8 0 bottom
R50  10kΩ 0.1%  [1608]  32.7,55.3 90 bottom
R51  12mΩ 1%  [3216-KELVIN]  29.5,55.9 180 bottom
R52  100kΩ 0.1%  [1608]  89.5,56.4 270 bottom
R53  10kΩ 0.1%  [1608]  37.7,56.8 270 bottom
R54  12mΩ 1%  [3216-KELVIN]  24.8,57.7 180 bottom
R55  10kΩ 0.1%  [1608]  32.7,59.4 90 bottom
R56  12mΩ 1%  [3216-KELVIN]  29.5,60 180 bottom
R57  10kΩ 0.1%  [1608]  37.7,61 270 bottom
R58  12mΩ 1%  [3216-KELVIN]  24.8,61.8 180 bottom
R59  10kΩ 0.1%  [1608]  32.7,63.5 90 bottom
R60  12mΩ 1%  [3216-KELVIN]  29.5,64.1 180 bottom
R61  10kΩ 0.1%  [1608]  37.7,65.1 270 bottom
R62  12mΩ 1%  [3216-KELVIN]  24.8,65.9 180 bottom
R63  10kΩ 0.1%  [1608]  32.7,67.6 90 bottom
R64  12mΩ 1%  [3216-KELVIN]  29.5,68.2 180 bottom
R65  10kΩ 0.1%  [1608]  37.7,69.2 270 bottom
R66  12mΩ 1%  [3216-KELVIN]  24.8,70 180 bottom
R67  0Ω <20mΩ  [1608]  73.6,71 90 bottom
R68  10kΩ 0.1%  [1608]  32.7,71.7 90 bottom
R69  12mΩ 1%  [3216-KELVIN]  29.5,72.3 180 bottom
R70  10kΩ 0.1%  [1608]  83.4,72.7 270 bottom
R71  12mΩ 1%  [3216-KELVIN]  79.9,72.8 180 bottom
R72  10kΩ 0.1%  [1608]  37.7,73.3 270 bottom
R73  12mΩ 1%  [3216-KELVIN]  24.8,74.1 180 bottom
R74  10kΩ 0.1%  [1608]  32.7,75.8 90 bottom
R75  12mΩ 1%  [3216-KELVIN]  29.5,76.4 180 bottom
R76  10kΩ 0.1%  [1608]  37.7,77.4 270 bottom
R77  12mΩ 1%  [3216-KELVIN]  24.8,78.2 180 bottom
R78  10kΩ 0.1%  [1608]  32.7,79.9 90 bottom
R79  12mΩ 1%  [3216-KELVIN]  29.5,80.5 180 bottom
R80  10kΩ 0.1%  [1608]  37.7,81.4 270 bottom
R81  12mΩ 1%  [3216-KELVIN]  24.8,82.3 180 bottom
R82  10kΩ 0.1%  [1608]  32.7,84 90 bottom
R83  12mΩ 1%  [3216-KELVIN]  29.5,84.6 180 bottom
R84  1kΩ 0.1%  [1608]  71.8,85.6 270 bottom
R85  10kΩ 0.1%  [1608]  37.7,85.6 270 bottom
R86  12mΩ 1%  [3216-KELVIN]  24.8,86.4 180 bottom
R87  10kΩ 0.1%  [1608]  32.7,88.1 90 bottom
R88  12mΩ 1%  [3216-KELVIN]  29.5,88.7 180 bottom
R89  10kΩ 0.1%  [1608]  37.7,89.6 270 bottom
R90  12mΩ 1%  [3216-KELVIN]  24.8,90.5 180 bottom
R91  10kΩ 0.1%  [1608]  32.1,90.9 0 bottom
R92  0Ω <20mΩ  [1608]  86.2,91.9 180 bottom
RN1  10kΩ 1%  [1632]  18.3,42.5 270 top
RN2  10kΩ 1%  [1632]  21.4,42.5 90 top
RN3  5kΩ 0.1%  [1616]  25.1,6.1 0 bottom
RN4  10kΩ 5%  [3264]  27.5,12.9 180 bottom
RN5  10kΩ 1%  [1632]  76.7,13.3 270 bottom
RN6  5kΩ 0.1%  [1616]  71.9,14.4 0 bottom
RN7  5kΩ 0.1%  [1616]  69.1,14.4 0 bottom
RN8  5kΩ 0.1%  [1616]  66.3,14.4 0 bottom
RN9  5kΩ 0.1%  [1616]  63.5,14.4 0 bottom
RN10  5kΩ 0.1%  [1616]  79.9,22.3 270 bottom
RN11  5kΩ 0.1%  [1616]  79.9,25.1 270 bottom
RN12  10kΩ 5%  [3264]  67.9,29.1 270 bottom
RN13  5kΩ 0.1%  [1616]  82.2,33.3 270 bottom
RN14  5kΩ 0.1%  [1616]  29.7,47.5 90 bottom
RN15  10kΩ 5%  [3264]  62.3,60.9 180 bottom
RN16  5kΩ 0.1%  [1616]  82.8,67 90 bottom
RN17  5kΩ 0.1%  [1616]  82.8,69.8 90 bottom
RN18  10kΩ 5%  [3264]  54.2,76.1 270 bottom
RN19  10kΩ 5%  [3264]  49.2,80.9 270 bottom
RN20  5kΩ 0.1%  [1616]  82.5,86 180 bottom
RN21  5kΩ 0.1%  [1616]  79.7,86 180 bottom
RN22  5kΩ 0.1%  [1616]  76.9,86 180 bottom
RN23  5kΩ 0.1%  [1616]  74.1,86 180 bottom
RT1  10kΩ 5%  [1608]  64.1,75.1 180 top
RT2  10kΩ 5%  [1608]  35.5,20.7 180 top
RT3  10kΩ 5%  [1608]  88.2,3.9 180 bottom
RT4  10kΩ 5%  [1608]  8.1,4 0 bottom
RT5  10kΩ 5%  [1608]  64.6,7.9 0 bottom
RT6  10kΩ 5%  [1608]  47.5,34.8 180 bottom
RT7  10kΩ 5%  [1608]  79.4,35.8 0 bottom
RT8  10kΩ 5%  [1608]  20.2,49.2 180 bottom
RT9  10kΩ 5%  [1608]  58.7,87.9 180 bottom
RT10  10kΩ 5%  [1608]  86.2,90.2 180 bottom
RT11  10kΩ 5%  [1608]  29.2,91.9 0 bottom
SW1  ESE24MH1  [ESE24MH1]  84.35,52.05 180 bottom
TP1  TEST_POINT-SMD-C-1.25  [SMD-C-1.25]  58.9,91.7 180 top
TP2  TEST_POINT-SMD-C-1.25  [SMD-C-1.25]  58.9,88.2 0 top
TP3  TEST_POINT-SMD-C-1.25  [SMD-C-1.25]  58.9,85.6 0 top
TP4  TEST_POINT-SMD-C-1.25  [SMD-C-1.25]  85.5,80.9 0 top
TP5  TEST_POINT-SMD-C-1.25  [SMD-C-1.25]  84.8,78.8 0 top
TP6  TEST_POINT-SMD-C-1.25  [SMD-C-1.25]  82.2,77.6 0 top
TP7  TEST_POINT-SMD-C-1.25  [SMD-C-1.25]  47.4,75.6 0 top
TP8  TEST_POINT-SMD-C-1.25  [SMD-C-1.25]  50.1,75.6 0 top
TP9  TEST_POINT-SMD-C-1.25  [SMD-C-1.25]  55.9,75.4 0 top
TP10  TEST_POINT-SMD-C-1.25  [SMD-C-1.25]  53.7,61.8 270 top
TP11  TEST_POINT-SMD-C-1.25  [SMD-C-1.25]  15.7,51.5 0 top
TP12  TEST_POINT-SMD-C-1.25  [SMD-C-1.25]  38.1,49.8 0 top
TP13  TEST_POINT-SMD-C-1.25  [SMD-C-1.25]  15.7,48.7 0 top
TP14  TEST_POINT-SMD-C-1.25  [SMD-C-1.25]  24.3,48.4 0 top
TP15  TEST_POINT-SMD-C-1.25  [SMD-C-1.25]  26.4,48.4 0 top
TP16  TEST_POINT-SMD-C-1.25  [SMD-C-1.25]  23.8,46.4 0 top
TP17  TEST_POINT-SMD-C-1.25  [SMD-C-1.25]  25.9,46.4 0 top
TP18  TEST_POINT-THT-0.7  [THT-0.7]  30.4,44.7 0 top
TP19  TEST_POINT-SMD-C-1.25  [SMD-C-1.25]  9.1,42.1 0 top
TP20  TEST_POINT-SMD-C-1.25  [SMD-C-1.25]  80.1,41.5 0 top
TP21  TEST_POINT-SMD-C-1.25  [SMD-C-1.25]  9.1,40 0 top
TP22  TEST_POINT-SMD-C-1.25  [SMD-C-1.25]  82.3,39.7 0 top
TP23  TEST_POINT-SMD-C-1.25  [SMD-C-1.25]  16.6,38.1 270 top
TP24  TEST_POINT-SMD-C-1.25  [SMD-C-1.25]  9.1,37.9 0 top
TP25  TEST_POINT-SMD-C-1.25  [SMD-C-1.25]  16.6,36 270 top
TP26  TEST_POINT-SMD-C-1.25  [SMD-C-1.25]  9.2,35.8 0 top
TP27  TEST_POINT-SMD-C-1.25  [SMD-C-1.25]  82.1,34 180 top
TP28  TEST_POINT-SMD-C-1.25  [SMD-C-1.25]  38.1,20.5 0 top
TP29  TEST_POINT-SMD-C-1.25  [SMD-C-1.25]  45.5,20.5 0 top
TP30  TEST_POINT-SMD-C-1.25  [SMD-C-1.25]  49.7,20.5 0 top
TP31  TEST_POINT-SMD-C-1.25  [SMD-C-1.25]  65.5,20.4 0 top
TP32  TEST_POINT-SMD-C-1.25  [SMD-C-1.25]  47.6,20.3 0 top
TP33  TEST_POINT-SMD-C-1.25  [SMD-C-1.25]  63,19.5 0 top
TP34  TEST_POINT-SMD-C-1.25  [SMD-C-1.25]  86.6,17.8 0 top
TP35  TEST_POINT-SMD-C-1.25  [SMD-C-1.25]  88.7,17.8 180 top
TP36  TEST_POINT-SMD-C-1.25  [SMD-C-1.25]  29.5,16.5 0 top
TP37  TEST_POINT-SMD-C-1.25  [SMD-C-1.25]  88.7,15.7 180 top
TP38  TEST_POINT-SMD-C-1.25  [SMD-C-1.25]  37.3,7.4 0 top
U1  INA199C2  [SOT363]  22.1,5.8 0 bottom
U2  AD7291  [QFN-20-4040]  31.3,7.7 270 bottom
U3  INA199C2  [SOT363]  58.3,12 270 bottom
U4  AD8515  [SOT23-5]  33.2,12.9 90 bottom
U5  TXS0102DQM  [X2SON-8]  81.3,13.3 270 bottom
U6  INA199C1  [SOT363]  87.8,22.8 270 bottom
U7  AD8515  [SOT23-5]  68.3,23.5 180 bottom
U8  AD7689  [QFN-20-4040]  50.2,24.3 180 bottom
U9  AD7291  [QFN-20-4040]  62,25.9 0 bottom
U10  INA199C1  [SOT363]  39,27.3 180 bottom
U11  AD7689  [QFN-20-4040]  80.2,29.2 0 bottom
U12  INA199C2  [SOT363]  87.8,29.5 90 bottom
U13  INA199C2  [SOT363]  60.3,30 180 bottom
U14  TXS0102DQM  [X2SON-8]  19.4,32.1 90 bottom
U15  TXS0102DQM  [X2SON-8]  19.4,35 90 bottom
U16  BQ29700  [WSON-6]  14,35.7 0 bottom
U17  AD8515  [SOT23-5]  83.2,36.7 0 bottom
U18  TPS64200  [SOT23-6]  50.1,38.7 180 bottom
U19  TXS0102DQM  [X2SON-8]  20,41 270 bottom
U20  TXS0102DQM  [X2SON-8]  20,43.9 270 bottom
U21  BQ29700  [WSON-6]  13.6,46.7 270 bottom
U22  INA199C1  [SOT363]  34.5,47.4 180 bottom
U23  INA199C2  [SOT363]  49.3,54.6 270 bottom
U24  INA199C2  [SOT363]  47.9,59.2 0 bottom
U25  INA199C2  [SOT363]  44.6,59.2 0 bottom
U26  AD7291  [QFN-20-4040]  52.9,61.3 270 bottom
U27  INA199C2  [SOT363]  47.8,62 0 bottom
U28  INA199C2  [SOT363]  44.6,62 0 bottom
U29  INA199C2  [SOT363]  47.9,64.8 0 bottom
U30  INA199C2  [SOT363]  44.6,64.8 0 bottom
U31  INA199C2  [SOT363]  78.9,67.1 90 bottom
U32  INA199C2  [SOT363]  47.9,67.6 0 bottom
U33  INA199C2  [SOT363]  44.6,67.6 0 bottom
U34  INA199C2  [SOT363]  86.4,67.7 270 bottom
U35  AD7291  [QFN-20-4040]  52.9,68.5 270 bottom
U36  INA199C2  [SOT363]  47.9,70.4 0 bottom
U37  INA199C2  [SOT363]  44.6,70.4 0 bottom
U38  INA199C2  [SOT363]  47.9,73.2 0 bottom
U39  INA199C2  [SOT363]  44.6,73.2 0 bottom
U40  INA199C1  [SOT363]  87,75.5 270 bottom
U41  STM32L476RGT  [QFP-64-1010]  65.9,77.4 90 bottom
U42  AD7689  [QFN-20-4040]  81.2,81.8 0 bottom
U43  INA199C2  [SOT363]  44.8,82.7 0 bottom
U44  INA199C2  [SOT363]  41.5,82.7 0 bottom
U45  INA199C2  [SOT363]  44.1,85.5 0 bottom
U46  INA199C2  [SOT363]  40.8,85.5 0 bottom
U47  INA199C2  [SOT363]  44.1,88.3 0 bottom
U48  INA199C2  [SOT363]  40.8,88.3 0 bottom
U49  AD7291  [QFN-20-4040]  49.7,89.1 270 bottom
U50  INA199C2  [SOT363]  44.1,91.1 0 bottom
U51  INA199C2  [SOT363]  40.8,91.1 0 bottom
Y1  32.768kHz ±10ppm  [SMD-3215]  71,68.2 180 bottom
Y2  8MHz ±10ppm  [SMD-5032]  65.7,68.5 0 bottom

## Tracks (layer width: path | path; a pad name or v marks a point on that pad's centre or on a via)
3.3V  (via drill 0.3)
  Top 0.2: RN1.8 RN1.7 19,42.5 | 19,42.5 RN1.6 RN1.5 | 20.7,42.5 RN2.7 RN2.8 20.65,41.25 DS3.A | 20.7,42.5 RN2.6 RN2.5 | 20.7,42.5 v19.85,42.5 19,42.5
  Route15 0.2: v50.7,57.7 50.7,59.4 | 50.7,59.4 v50.7,64.9 | v69.8,85.9 69.2,85.3 69.2,82.6 | 69.2,82.6 69.2,81.6 | 69.2,81.6 69.2,73.5 | 69.2,73.5 v74.4,73.5 74.5,73.6 77,73.6 79.46,71.14 79.46,69.96 v79,69.5 | v47.5,85.5 51.4,81.6 v58.3,81.6 69.2,81.6 | v76.8,82.6 69.2,82.6 | v57.5,74.6 58.6,73.5 69.2,73.5 | v34.2,50.4 35.7,51.9 53,51.9 54.4,53.3 54.4,59.4 | 20.7,39.6 v20.7,36.6 v20.7,33.5 20.7,27.3 13.6,20.2 13.6,14.3 17,10.9 26.7,10.9 | 20.7,39.6 20.7,41.65 v19.85,42.5 19.85,64.25 22,66.4 v27.5,66.4 | v17.59,39.57 17.62,39.6 20.7,39.6 | 26.7,10.9 57.2,10.9 | v76.8,32.8 77,32.6 77,30.6 75.2,28.8 75.2,28.3 71.8,24.9 59.4,24.9 v57.2,27.1 57.2,22.6 | 57.2,22.6 57.2,10.9 | v79.2,11.8 78.3,10.9 v76,10.9 72.2,10.9 | 72.2,10.9 61.2,10.9 | 61.2,10.9 57.2,10.9 | v72.2,11.4 72.2,10.9 | v61.2,9.7 61.2,10.9 | 57.2,22.6 v54.7,22.6 51.7,22.6 v48.5,19.4 | 54.4,59.4 64.9,59.4 69.2,63.7 69.2,70.6 | 54.4,59.4 50.7,59.4 | 69.2,73.5 69.2,70.6 | v69.66,70.6 69.2,70.6 | v31.8,4.9 30.3,6.4 v26.7,6.4 26.7,10.9
  Route15 0.6: v31.9,68.7 v31.9,72.8 v31.9,76.9 v31.9,81 v31.9,85.1 v31.9,89.2 | v27.5,91 v27.5,86.9 v27.5,82.8 v27.5,78.7 v27.5,74.6 v27.5,70.5 v27.5,66.4 29.6,66.4 v31.9,68.7 | v31.9,68.7 34.2,66.4 v34.2,50.4
  Bottom 0.2: v31.9,68.7 32.35,68.7 R63.2 32.8,68.45 R65.2 | v31.9,72.8 32.35,72.8 R68.2 32.8,72.55 R72.2 | v31.9,76.9 32.35,76.9 R74.2 32.8,76.65 R76.2 | v31.9,81 32.35,81 R78.2 R80.2 | v31.9,85.1 32.35,85.1 R82.2 32.8,84.85 R85.2 | v31.9,89.2 32.35,89.2 R87.2 R89.2 | R91.2 31.32,90.87 27.62,90.87 v27.5,91 | v20.7,33.5 21.35,32.85 C30.1 21.35,32.7 U14.1 U14.8 | v20.7,36.6 20.7,36.55 C32.1 21.35,35.6 U15.1 U15.8 | U49.17 U49.16 47.8,86.1 48.25,85.65 C92.1 | C92.1 v47.5,85.5 | U35.17 U35.16 51,65.5 51.45,65.05 C65.1 v50.7,64.9 | U26.17 U26.16 51,58.3 51.45,57.85 C55.1 v50.7,57.7 | U49.11 50.7,86.4 51.1,86 51.1,85.3 50.5,84.7 48.9,84.7 48.25,85.35 C92.1 | U41.32 59.65,81.15 58.55,82.25 C85.1 v58.3,81.6 | U41.48 69.65,84.45 70.15,84.95 C91.1 70.15,85.25 69.8,85.6 v69.8,85.9 | U41.64 72.95,73.65 73.45,73.15 C77.1 73.75,73.15 74.1,73.5 v74.4,73.5 | U41.19 58.65,74.65 58.55,74.75 C78.1 58.25,74.75 58.1,74.6 v57.5,74.6 | U42.15 78.3,82.8 77.75,82.25 C87.1 77.25,82.6 v76.8,82.6 | v34.2,50.4 34.2,49.9 | 34.2,49.9 v34.2,49.8 v34.2,49.1 | v34.2,49.1 v34.9,49.1 v35.6,49.1 | R43.2 34.2,49.9 | U41.1 v69.65,70.61 v69.66,70.6 | RN16.2 81.03,67.47 v79,69.5 | U20.8 U20.1 18.05,43.3 C41.1 18.05,43.15 18.7,42.5 v19.85,42.5 | U19.8 U19.1 18.05,40.4 C38.1 17.59,39.95 v17.59,39.57 | R29.2 83.35,38.75 82.25,37.65 U17.5 81.89,37.09 80.8,36 80.8,35.2 80.6,35 79.4,35 | U11.15 78.3,32.75 C31.1 | C31.1 78.25,33.05 79.4,34.2 79.4,35 | FB1.1 75.75,39.05 76.5,38.3 79.1,38.3 79.4,38 79.4,35 | U9.17 U9.16 58.9,27.8 58.55,27.45 C22.1 57.55,27.45 v57.2,27.1 | v76.8,32.8 C31.1 | U5.8 U5.1 79.35,12.7 C12.1 v79.2,11.8 | RN5.8 RN5.7 RN5.6 RN5.5 v76,10.9
  Bottom 0.2: R13.2 71.6,10.85 72.15,11.4 v72.2,11.4 | R14.2 v61.2,9.7 | U8.15 53.75,23.3 C18.1 53.95,23.25 54.6,22.6 v54.7,22.6 | v34.2,49.1 30.13,49.1 RN14.2 | R15.2 v48.5,19.4 | U2.17 U2.16 28.2,6.7 27.85,6.35 C7.1 27.65,6.4 v26.7,6.4 26.4,6.1 25.2,6.1 24.63,5.53 RN3.2 | U2.11 32.3,5.2 32,4.9 v31.8,4.9 31.6,4.9 31.3,5.2 U2.13
  Bottom 0.6: R64.2 v31.9,68.7 | R69.2 v31.9,72.8 | R75.2 v31.9,76.9 | R79.2 v31.9,81 | R83.2 v31.9,85.1 | R88.2 v31.9,89.2 | R90.2 v27.5,91 | R86.2 v27.5,86.9 | R81.2 v27.5,82.8 | R77.2 v27.5,78.7 | R73.2 v27.5,74.6 | R66.2 v27.5,70.5 | R62.2 v27.5,66.4
  pour Bottom (rank 2, no thermals): 35.7,50.2 36,49.9 36,48.9 35.8,48.7 34,48.7 33.8,48.9 33.8,50.4 34,50.6 34.4,50.6 34.4,50.4 34.6,50.2
  pour Route15 (rank 2, no thermals): 90.9,89.4 90.9,96.3 9.5,96.3 9.5,84.6 -0.5,84.6 -0.5,32.2 10.8,32.2 10.8,18.8 10.3,18.3 1.5,18.3 1.5,-0.5 58.3,-0.5 58.3,4.77 59.03,5.5 84.5,5.5 85,6 85,18.9 84.5,19.4 81.03,19.4 80.3,20.13 80.3,27.63 77.4,30.53 77.4,36.2 69.7,36.2 69.2,35.7 69.2,33 68.7,32.5 66.3,32.5 65.8,32 65.8,27.96 65.14,27.3 26.57,27.3 19.17,19.9 18.23,19.9 17.6,20.53 17.6,21.47 21.6,25.47 21.6,64.57 22.33,65.3 33.17,65.3 33.9,64.57 33.9,47.8 34.4,47.3 48.73,47.3 51.43,50 58.1,50 58.5,50.4 63.9,50.4 64.31,50.81 64.31,58.45 77.36,71.5 79.1,71.5 79.1,75.67 79.83,76.4 87.1,76.4 87.4,76.7 87.4,79.6 85.1,81.9 85.1,88.87 85.63,89.4
  pour Route2 (no thermals): 33.9,50.5 33.9,49 34.1,48.8 35.7,48.8 35.9,49 35.9,49.2 34.4,50.7 34.1,50.7
  pour Top (no thermals): 33.9,50.5 33.9,49 34.1,48.8 35.7,48.8 35.9,49 35.9,49.2 34.4,50.7 34.1,50.7
3.3V_I  (via drill 0.3)
  Top 0.2: v38,48.7 38.1,48.8 TP12.1
  Bottom 0.2: R38.2 48.75,46.85 48.25,46.35 C45.1 41.81,46.35 | 41.81,46.35 L1.2 | 41.81,46.35 41.78,46.38 41.78,46.68 40.9,47.56 C49.A 40.5,49.8 38,49.8 | R43.1 38,49.8 | 38,49.8 v38,48.7 38,47.85 C46.1
  pour Bottom (rank 2, no thermals): 46.2,44.3 46.2,46.5 45.7,47 42.5,47 42,47.5 42,51.1 39.5,51.1 38.6,50.2 37.5,50.2 37.5,48.9 36.6,48 36.6,46.8 37.3,46.8 39.8,44.3
3.3V_ISENS
  Bottom 0.2: Q8.5 Q8.6 44,34.75 | 44,34.75 Q8.7 Q8.8 | 44,35.6 Q8.PAD 44.38,35.97 45.5,37.1 49.8,37.1 50.1,37.4 50.1,38.7 51.05,39.65 U18.4 | 44,35.6 44,34.75 | R20.1 44,35.6
  pour Bottom (no thermals): 40.7,36.4 42.4,36.4 42.8,36.8 45.2,36.8 45.2,34.5 42.8,34.5 42.5,34.8 40.7,34.8
3.3V_LED  (via drill 0.3)
  Top 0.16: DS3.C 22.15,39.65 23.3,40.8 23.55,40.8 27.6,44.85 v27.6,44.9
  Bottom 0.16: R34.2 28.15,45.35 27.7,44.9 v27.6,44.9
3.3V_REG_BUCK_NODE
  Bottom 0.2: Q8.3 Q8.2 Q8.1 | Q8.1 41.4,37.85 R25.2 | Q8.1 43.02,40.41 L1.1 42.86,40.3 D5.C
  pour Bottom (no thermals): 35.9,39 42.1,39 42.9,38.2 42.9,37.6 44.4,37.6 44.4,38.2 45.8,39.6 46.2,39.6 46.2,41.3 38.6,41.3 38.3,41.6 35.9,41.6
3.3V_REG_FB
  Bottom 0.2: R36.1 49.65,44.9 | 49.65,44.9 R33.2 49.65,44.35 48.79,43.49 U18.3 | C45.2 49.6,44.85 49.65,44.9
3.3V_REG_FBRES_HIGH
  Bottom 0.2: R36.2 51.15,46.85 50.25,47.75 R38.1
3.3V_REG_FBRES_LOW
  Bottom 0.2: R31.2 49.65,42.95 51.15,44.45 R33.1
3.3V_REG_INCAP
  Bottom 0.2: C29.2 41.1,30.25 C28.1
  pour Bottom (no thermals): 40.7,31.1 41.5,31.1 42,30.6 44,30.6 44,29.9 41.9,29.9 41.5,29.5 40.7,29.5
3.3V_REG_OUTCAP
  Bottom 0.2: C42.1 37.05,44.7 C46.2
  pour Bottom (rank 2, no thermals): 38.3,44 35.8,44 35.6,43.8 34.9,43.8 34.9,45.6 35.6,45.6 36.5,44.7 38.3,44.7
3.3V_REG_RSENS
  Bottom 0.2: R20.2 38.2,35.55 R18.1
  pour Bottom (no thermals): 37.7,36.4 37.7,33.1 38.7,33.1 38.7,36.4
3.3V_REG_SNUBBER
  Bottom 0.2: C36.1 R25.1
  pour Bottom (no thermals): 38.1,38.1 40,38.1 40,37.3 38.1,37.3
3.3V_REG_SW
  Bottom 0.2: R23.1 49.65,36.35 51.05,37.75 U18.6
3.3V_REG_SW_GATE
  Bottom 0.2: R23.2 Q8.4
!NRST  (via drill 0.3)
  Top 0.16: v73.6,67.89 72.82,67.11 72.82,63.7 67.34,58.22 67.34,54.13 66.58,53.38 66.58,39.88 65.6,38.9 65.6,38.44 58.29,31.13 49.95,31.13 44.56,25.73 44.56,23.27 44.45,23.16 44.45,19.54 42.8,17.9 v42.7,17.9
  Bottom 0.16: C66.1 v73.6,67.89 73.6,68.79 69.89,72.5 66.8,72.5 66.65,72.35 U41.7 | J13.5 41.19,17.59 41.5,17.9 v42.7,17.9
!PC_3.3V-0
  Bottom 0.16: Q42.4 14.28,91.67 14.77,92.16 17.64,92.16 18.16,91.63 27.62,91.63 28.05,91.21 30.57,91.21 31,91.63 32.9,91.63 | Q43.6 34.23,91.63 32.9,91.63 | R91.1 32.9,90.95 32.9,91.63
!PC_3.3V-1
  Bottom 0.16: Q41.4 18.77,89.97 19.27,90.47 22.14,90.47 22.5,90.1 22.5,89.6 22.71,89.38 26.89,89.38 27.32,89.81 35.62,89.81 Q43.3 R89.1
!PC_3.3V-2
  Bottom 0.16: Q39.4 14.28,87.57 14.77,88.06 17.64,88.06 18.16,87.53 32.52,87.53 R87.1 32.85,87.35 33.15,87.65 Q40.6
!PC_3.3V-3
  Bottom 0.16: Q38.4 18.77,85.88 19.27,86.37 22.14,86.37 22.5,86 22.5,85.5 22.71,85.28 26.89,85.28 27.32,85.72 35.52,85.72 Q40.3 R85.1
!PC_3.3V-4
  Bottom 0.16: Q36.4 14.28,83.47 14.77,83.97 17.64,83.97 18.16,83.44 32.52,83.44 R82.1 32.85,83.25 33.15,83.55 Q37.6
!PC_3.3V-5  (via drill 0.3)
  Top 0.16: v29.5,81.3 27.14,81.3 20.4,74.56 20.4,46.37 21.4,45.36 21.4,37.4 v21.3,37.3
  Bottom 0.16: Q35.4 18.77,81.78 19.27,82.27 22.14,82.27 22.5,81.9 22.5,81.4 22.71,81.19 26.89,81.19 27.32,81.62 29.6,81.62 | R80.1 37.6,82.25 Q37.3 35.52,81.62 29.6,81.62 | 29.6,81.62 29.5,81.52 v29.5,81.3 | Q9.3 21.25,37.25 v21.3,37.3
!PC_3.3V-6
  Bottom 0.16: Q33.4 14.28,79.38 14.77,79.86 17.64,79.86 18.16,79.33 32.52,79.33 R78.1 32.85,79.15 33.15,79.45 Q34.6
!PC_3.3V-7
  Bottom 0.16: Q32.4 18.77,77.67 19.27,78.16 22.14,78.16 22.5,77.8 22.5,77.3 22.71,77.08 26.89,77.08 27.32,77.52 35.52,77.52 Q34.3 R76.1
!PC_3.3V-8
  Bottom 0.16: Q29.4 14.28,75.28 14.77,75.77 17.64,75.77 18.16,75.23 32.52,75.23 R74.1 32.85,75.05 33.15,75.35 Q30.6
!PC_3.3V-9
  Bottom 0.16: Q28.4 18.77,73.58 19.27,74.06 22.14,74.06 22.5,73.7 22.5,73.2 22.71,72.98 26.89,72.98 27.4,73.5 35.6,73.5 Q30.3 R72.1
!PC_3.3V-10
  Bottom 0.16: Q26.4 14.28,71.17 14.77,71.66 17.64,71.66 18.16,71.13 32.52,71.13 R68.1 32.85,70.95 33.15,71.25 Q27.6
!PC_3.3V-11
  Bottom 0.16: Q25.4 18.77,69.47 19.27,69.97 22.14,69.97 22.5,69.6 22.5,69.1 22.71,68.88 26.89,68.88 27.32,69.31 35.52,69.31 Q27.3 R65.1
!PC_3.3V-12
  Bottom 0.16: Q23.4 14.28,67.08 14.77,67.56 17.64,67.56 18.16,67.03 32.34,67.03 32.52,66.85 R63.1 32.85,66.85 33.15,67.15 Q24.6
!PC_3.3V-PV
  Bottom 0.16: Q4.3 71.6,9.25 R13.1 70.45,9.35 70.08,9.73 Q5.4
!PC_BATT-0
  Bottom 0.16: Q22.4 18.77,65.38 19.27,65.86 22.14,65.86 22.5,65.5 22.5,65 22.71,64.78 26.89,64.78 27.32,65.22 35.52,65.22 Q24.3 R61.1
!PC_BATT-1
  Bottom 0.16: Q20.4 14.28,62.97 14.77,63.46 17.64,63.46 18.16,62.94 32.52,62.94 R59.1 32.85,62.75 33.15,63.05 Q21.6
!PC_BATT-2
  Bottom 0.16: Q19.4 18.77,61.27 19.27,61.77 22.14,61.77 22.5,61.4 22.5,60.9 22.71,60.69 26.89,60.69 27.32,61.11 35.52,61.11 Q21.3 R57.1
!PC_BATT-3
  Bottom 0.16: Q17.4 14.28,58.88 14.77,59.36 17.64,59.36 18.16,58.84 32.52,58.84 R55.1 32.85,58.65 33.15,58.95 Q18.6
!PC_BATT-4
  Bottom 0.16: Q14.4 18.77,57.17 19.27,57.66 22.14,57.66 22.5,57.3 22.5,56.8 22.71,56.59 26.89,56.59 27.32,57.02 35.52,57.02 Q18.3 37.6,57.65 R53.1
!PC_BATT-5
  Bottom 0.16: Q12.4 14.28,54.77 14.77,55.27 17.64,55.27 18.16,54.73 32.52,54.73 R50.1 32.85,54.55 33.15,54.85 Q13.6
!PC_BATT-6
  Bottom 0.16: Q10.4 18.77,53.07 19.27,53.56 22.14,53.56 22.5,53.2 22.5,52.7 22.71,52.48 26.89,52.48 27.32,52.91 32.7,52.91 | Q13.3 35.52,52.91 32.7,52.91 | R46.1 32.7,52.91
!PC_BH-0
  Bottom 0.16: Q11.4 62.62,51.7 62.95,51.7 63.95,52.69 R48.1 63.95,55.25 Q16.6
!PC_BH-1
  Bottom 0.16: Q15.6 66.61,55.11 66.61,53.41 65.98,52.79 64.96,52.79 61.72,49.55 61.72,45.36 60.7,44.34 R22.1 Q7.4
!PC_DP-0  (via drill 0.3)
  Top 0.16: v76.44,72.94 74.77,72.94 v74.28,72.45
  Bottom 0.16: R70.1 82.85,73.45 82.36,73.94 82.36,77.64 81.95,78.05 Q31.4 81.58,77.47 81.41,77.31 78.61,77.31 76.22,74.92 76.22,73.16 v76.44,72.94 | v74.28,72.45 74.29,72.44 74.29,64.25 68.65,58.61 Q15.3
!PC_DP-1  (via drill 0.3)
  Top 0.16: v56.4,38.7 56.4,34.55 55.9,34.05 48.72,34.05 42.51,27.84 36.92,27.84 35.35,26.26 35.35,23.75 21.3,9.7 v14.3,9.7
  Bottom 0.16: Q16.3 66.29,57.31 66.29,53.55 65.85,53.11 64.83,53.11 61.4,49.68 61.4,45.5 57.1,41.2 56.7,41.2 56.1,40.6 56.1,39 v56.4,38.7 | Q3.4 14.05,8.55 15.05,9.55 R12.1 v14.3,9.7
ADC_3.3V
  Bottom 0.16: RN14.4 RN14.3 31.12,48.69 33.7,48.69 34.4,47.99 34.4,46.04 34.15,45.79 34.15,42.53 35.1,41.58 35.1,29.79 36.3,28.59 38.31,28.59 38.82,28.08 38.82,26.36 39.3,25.89 43.23,25.89 44.7,27.35 48.36,27.35 49.2,26.51 U8.6
ADC_DCAP-3
  Bottom 0.16: U49.8 52.3,89.1 52.5,88.9 53.9,88.9 54.65,88.15 C93.1
ADC_DCAP-4
  Bottom 0.16: U35.8 55.3,68.5 55.5,68.3 57.1,68.3 57.85,67.55 C69.1
ADC_DCAP-5
  Bottom 0.16: U26.8 55.3,61.3 55.5,61.1 57.1,61.1 57.85,60.35 C57.1
ADC_DCAP-6
  Bottom 0.16: U9.8 62,23.3 61.8,23.1 61.8,21.7 61.05,20.95 C15.1
ADC_DCAP-7
  Bottom 0.16: U2.8 33.7,7.7 34.3,7.1 35.44,7.1 36.25,6.29 C6.1
ADC_EJECT_TIMER_BUF
  Bottom 0.16: RN13.4 RN13.3 80.7,32.03 U11.19
ADC_PV_IN-0A
  Bottom 0.16: RN23.4 RN23.3 75.48,84.39 80,84.39 80.2,84.19 U42.16
ADC_PV_IN-0B
  Bottom 0.16: RN22.4 RN22.3 77.96,84.71 80.49,84.71 80.7,84.5 U42.17
ADC_PV_IN-1A
  Bottom 0.16: RN21.4 RN21.3 80.9,85.3 81.2,85 U42.18
ADC_PV_IN-1B
  Bottom 0.16: RN20.3 RN20.4 81.7,84.97 U42.19
ADC_PV_IN-2A
  Bottom 0.16: U8.18 50.2,22.08 51.77,20.52 56.26,20.52 58.8,17.98 62.95,17.98 RN8.3 RN8.4
ADC_PV_IN-2B
  Bottom 0.16: U8.19 49.7,22.08 51.59,20.2 56.12,20.2 58.66,17.66 60.47,17.66 RN9.3 RN9.4
ADC_PV_IN-3A
  Bottom 0.16: U8.17 50.7,22.08 51.95,20.84 56.39,20.84 58.93,18.3 65.43,18.3 RN7.3 RN7.4
ADC_PV_IN-3B
  Bottom 0.16: U8.16 51.2,22.08 52.12,21.16 56.52,21.16 59.06,18.62 67.91,18.62 RN6.3 RN6.4
ADC_REF-0  (via drill 0.3)
  Top 0.16: TP30.1 49.03,21.16 46.8,21.16 45.63,22.33 v45.63,22.64
  Bottom 0.16: U8.2 46.06,23.8 45.63,23.37 v45.63,22.64 45.63,22.23 45.25,21.85 C16.1
ADC_REF-1  (via drill 0.3)
  Top 0.16: TP4.1 85.5,83.28 v85.27,83.51
  Bottom 0.16: U42.2 83.7,82.3 83.8,82.2 85.34,82.2 85.49,82.35 85.49,83.29 v85.27,83.51 85.27,83.83 84.95,84.15 C90.1
ADC_REF-2  (via drill 0.3)
  Top 0.16: v84.02,30.8 82.66,32.16 82.66,33.45 82.11,34 TP27.1
  Bottom 0.16: U11.2 82.8,29.7 83.1,29.4 84.8,29.4 85.35,29.95 C26.1 84.65,30.8 v84.02,30.8
ADC_REF-3  (via drill 0.3)
  Top 0.16: v55.7,92.3 58.3,92.3 TP1.1
  Bottom 0.16: U49.7 52.3,89.6 52.6,89.3 53.9,89.3 54.65,90.05 C104.1 54.65,91.55 55.4,92.3 v55.7,92.3
ADC_REF-4  (via drill 0.3)
  Top 0.16: v57.2,70.8 55.9,72.1 TP9.1
  Bottom 0.16: U35.7 55.3,69 55.6,68.7 57.1,68.7 57.85,69.45 C75.1 v57.2,70.8
ADC_REF-5  (via drill 0.3)
  Top 0.16: TP10.1 57.4,61.8 v57.5,61.9
  Bottom 0.16: U26.7 55.3,61.8 55.6,61.5 57.1,61.5 v57.5,61.9 57.85,62.25 C61.1
ADC_REF-6  (via drill 0.3)
  Top 0.16: TP33.1 v63,20.95
  Bottom 0.16: U9.7 62.5,23.3 62.2,23 62.2,21.7 62.95,20.95 v63,20.95 C14.1 64.45,20.95 65.5,22 65.5,23.8 66.15,24.45 U7.3
ADC_REF-7  (via drill 0.3)
  Top 0.16: TP38.1 36.39,8.31 v36.25,8.31
  Bottom 0.16: U2.7 33.66,8.2 34.36,7.5 35.44,7.5 v36.25,8.31 C10.1 35.47,10.38 33.52,10.38 33.16,10.74 32.79,10.74 32.25,11.28 U4.3
ADC_REFIN-0
  Bottom 0.16: U8.3 47.6,24.3 47.5,24.2 46.06,24.2 45.25,25.01 C21.1
ADC_REFIN-1
  Bottom 0.16: C83.1 86.15,80.99 85.34,81.8 U42.3
ADC_REFIN-2
  Bottom 0.16: U11.3 82.8,29.2 83,29 84.4,29 84.6,28.8 84.6,27.6 85.15,27.05 C23.1
ADC_SEL-0  (via drill 0.3)
  Top 0.16: v71.94,26.93 72.12,26.93 72.13,26.95 v74.93,26.95
  Bottom 0.16: U41.61 72.45,75.15 72.81,75.51 74.41,75.51 75.26,74.66 75.26,72.45 76.37,71.34 76.37,63.38 73.46,60.47 73.46,58.11 68.97,53.62 68.97,46.61 70.54,45.04 70.54,40.99 71.14,40.39 71.14,34.53 75.55,30.13 75.55,27.87 74.78,27.1 v74.93,26.95 | v71.94,26.93 72.16,26.71 72.16,23.76 68.3,19.9 59.6,19.9 54.2,25.3 U8.11
ADC_SEL-1
  Bottom 0.16: U42.11 78.6,80.8 78.55,80.75 74.11,80.75 73.52,80.15 U41.51
ADC_SEL-2  (via drill 0.3)
  Top 0.16: v77.36,28.16 77.23,28.03 76.47,28.03 v75.64,27.2
  Bottom 0.16: U41.57 73.22,77.15 75.58,74.8 75.58,72.58 76.69,71.47 76.69,63.24 73.78,60.34 73.78,57.98 69.29,53.49 69.29,46.74 70.86,45.17 70.86,41.13 71.47,40.52 71.47,34.67 75.86,30.27 75.86,27.42 v75.64,27.2 | U11.11 77.41,28.2 v77.36,28.16
ADC_UMB_IN
  Bottom 0.16: U11.8 80.2,26.82 79.9,26.52 79.9,24 79.2,23.3 RN10.4 RN10.3
ADC_VBATT-A
  Bottom 0.16: U42.9 80.7,79.58 81.61,78.67 82.2,78.67 84.11,76.76 84.11,70.88 RN17.3 RN17.4
ADC_VBATT-B
  Bottom 0.16: U11.9 79.7,26.8 79.47,26.57 79.47,25.84 RN11.4 RN11.3
AGND  (via drill 0.3)
  Top 0.2: v83.8,80.1 82.6,78.9 v80.5,78.9 | v30.7,92.2 31.04,92.54 48.87,92.54 53.44,87.97 53.44,85.54 56.39,82.59 61.99,82.59 64.78,79.8 65.05,79.8 | v85.82,91 85.82,90.96 87.32,89.46 87.32,83.01 89.32,81.01 89.32,62.58 87.04,60.3 v83.1,60.3 | v66.61,86.11 65.05,84.55 65.05,79.8 | 65.05,79.8 65.05,75.3 RT1.1 64.85,75.33 62.3,77.89 60.7,77.89 60.01,77.19 60.01,74.6 60.56,74.06 60.56,52.8 63.36,50 63.36,46.31 60.4,43.35 60.4,36.45 57.34,33.39 49,33.39 40.99,25.38 40.99,20.66 34.39,14.06 31.25,14.06 30.92,14.38 30.92,14.85 31.25,15.18 33.22,15.18 v33.41,14.98 33.78,14.98 36.25,17.45 RT2.1 | v80.44,26.29 80.3,26.15 v80.3,23.5 80.3,21.7 84.2,17.8 TP34.1 | v74.87,42.52 74.87,42.49 75.39,41.96 78.73,41.96 v79.1,41.6 79.2,41.5 TP20.1 | v75.72,32.09 72.99,32.09 64.3,23.4 v64.3,23.2 61.3,23.2 60.86,23.63 60.86,26.84 v58.4,29.3 58.38,29.29 v54.56,29.29 54.56,29.26 v51.9,26.6 50.9,25.6 v46.1,25.6 46.19,25.51 46.19,22.26 46.95,21.5 48,21.5 v48.2,21.7 | v68.62,25.58 77.12,25.58 v77.2,25.5 | TP28.1 36.45,20.5 RT2.1 | RT2.1 36.25,25.15 v36.9,25.8
  Route2 0.2: v82.9,26.9 82.3,26.29 v80.44,26.29 79.11,26.29 v78.9,26.5
  Bottom 0.2: RN23.1 73.63,86.57 74.2,86 76.5,86 | 82.1,86 84.3,86 84.65,85.65 C90.2 84.95,85.65 85.83,84.77 85.83,81.8 86.71,80.91 86.71,78.71 86.15,78.15 | 82.1,86 79.3,86 | 79.3,86 76.5,86 | RN22.1 76.5,86.63 76.5,86 | RN21.1 79.3,86.63 79.3,86 | RN20.1 82.1,86.63 82.1,86 | RT9.1 58.66,88.61 59.95,88.61 60.71,87.85 64.59,87.85 66.33,86.11 v66.61,86.11 | 86.15,78.15 C81.2 86.15,77.15 86.35,76.95 U40.1 U40.2 87,75.8 87.3,75.5 87.8,75.5 88.11,75.19 88.11,74.19 86.9,72.98 86.9,71.45 C74.2 85.75,70.1 U34.1 U34.2 86.4,68 86.7,67.7 87.81,67.7 88.52,66.99 88.52,65.75 88.19,65.43 82.73,65.43 | 86.15,78.15 84.65,79.65 C83.2 84.2,79.7 v83.8,80.1 | U42.10 80.2,79.5 80.5,79.2 v80.5,78.9 | RN17.1 82.2,69.33 82.86,68.67 82.86,67.16 82.23,66.53 RN16.1 82.73,65.9 82.73,65.43 | RT11.1 30.4,91.9 v30.7,92.2 | v85.82,91 85.82,90.82 85.45,90.45 RT10.1 | U31.2 U31.1 79.55,65.63 81.25,63.94 | 81.25,63.94 80.88,63.58 80.88,60.3 | 81.25,63.94 82.73,65.43 | 80.88,60.3 80.88,60.27 77.75,57.14 74.33,57.14 70.27,53.07 70.27,47.16 71.61,45.82 72.47,45.82 72.96,45.34 72.96,44.96 74.87,43.05 v74.87,42.52 74.87,41.32 72.44,38.89 72.44,35.09 75.44,32.09 v75.72,32.09 | v83.1,60.3 80.88,60.3 | RT8.1 19.45,49.35 20.01,49.91 32.33,49.91 34.99,52.57 52.86,52.57 56.92,48.52 56.92,43.34 54.76,41.17 54.76,29.48 v54.56,29.29 52.12,29.29 46.75,34.65 RT6.1 | 82.9,34 82.9,35.5 84.1,36.7 U17.2 85.3,36.7 85.4,36.8 85.4,38.1 85,38.5 84.8,38.5 84.1,39.2 84.1,40 83.7,40.4 81.8,40.4 81.2,41 80.15,41 | 82.9,34 RN13.1 | 82.9,34 85.8,34 87.1,32.7 C33.C 86.6,31.6 86.6,30.1 87.2,29.5 88.4,29.5 89.2,28.7 89.2,27
  Bottom 0.2: U12.2 U12.1 88.45,27.1 C24.2 89.2,27 | U6.2 U6.1 87.15,25.2 C20.2 86.1,25.3 | C26.2 85.5,27.8 86.1,27.2 86.1,25.3 | 86.1,25.3 85.1,25.3 83.65,26.75 C23.2 v82.9,26.9 | 86.1,25.3 86.1,23.9 86.9,23.1 88.7,23.1 89.2,23.6 89.2,27 | U11.10 79.2,26.8 v78.9,26.5 | RN11.1 80.6,26.13 v80.44,26.29 | RN10.1 80.3,23.07 v80.3,23.5 | U22.2 U22.1 | U22.1 32.1,46.75 C47.2 31.8,46.45 29.58,46.45 RN14.1 | U10.2 U10.1 | U22.1 33.45,46.65 33.45,42.23 34.4,41.28 34.4,29.49 35.79,28.1 35.79,27.11 36.35,26.55 C25.2 | 80.15,41 C37.2 R24.1 RT7.1 | 80.15,41 80.15,41.35 80.4,41.6 | 80.4,41.6 C40.C | v79.1,41.6 80.4,41.6 | U9.6 63,22.7 62.75,22.45 C17.2 64.15,22.3 C14.2 v64.3,23.2 66.2,25.1 67.9,25.1 | C13.2 65.85,22.75 66.6,23.5 U7.2 67.4,23.5 67.9,24 67.9,25.1 | U13.2 U13.1 58.45,29.35 v58.4,29.3 | RT5.1 65.8,7.9 66.15,8.25 84.6,8.25 | RT3.1 87.45,4.05 84.6,6.9 84.6,8.25 | 67.9,25.1 68.14,25.1 v68.62,25.58 | v77.2,25.5 77.91,24.79 77.91,21.11 84.6,14.42 84.6,8.25 | RN6.1 72.37,13.83 71.8,14.4 69.57,14.4 | RN7.1 69.57,14.4 | 69.57,14.4 66.77,14.4 | 66.77,14.4 63.97,14.4 | 63.97,14.4 62.69,14.4 59.77,17.32 58.52,17.32 55.98,19.86 51.44,19.86 49.59,21.7 v48.2,21.7 C16.2 | v46.1,25.6 46.75,26.25 C21.2 46.04,27.01 44.84,27.01 43.38,25.55 39.15,25.55 U10.1 | RN9.1 63.97,14.4 | RN8.1 66.77,14.4 | v51.9,26.6 51.5,26.2 U8.10 U8.9 | U10.1 36.6,26.65 C25.2 | C25.2 36.55,26.55 36.9,26.2 v36.9,25.8 | 34.75,8.7 C10.2 34.75,9.65 34.36,10.04 33.01,10.04 32.33,10.72 31.83,10.72 31.68,10.87 31.68,12.31 31.84,12.46 32.73,12.46 33.2,12 U4.2 33.2,11.4 33.2,11.2 33.68,10.72 34.72,10.72 | 34.75,8.7 34.75,8.2 C8.2 | U2.6 34.75,8.7 | 34.72,10.72 35.52,10.72 36.05,11.25 C11.2 36.95,11.25 37,11.2
  Bottom 0.2: U3.2 U3.1 57.46,13.14 37.5,13.14 37,12.64 37,11.2 | 37,11.2 37,4.6 36.6,4.2 25.6,4.2 | RN3.1 25.6,5.37 25.6,4.2 | 25.6,4.2 25.6,4 22.4,4 | 22.4,4 RT4.1 | U1.1 U1.2 22.6,5.8 22.4,5.6 22.4,4 | v33.41,14.98 33.41,13.65 34.72,12.34 34.72,10.72
AVDD  (via drill 0.3)
  Top 0.2: v82.04,63.94 v81.25,64.73 | v84,31.6 83,32.6 83,39 TP22.1 82.3,40.59 80.49,42.4 v79.1,42.4 78.97,42.52 v75.63,42.52 | v60.5,21.8 60.5,22.64 | 60.5,22.64 60.5,26.69 58.47,28.72 v57.9,28.72 54.53,28.72 53.47,27.66 53.47,27.37 51.3,25.2 50.1,25.2 v47.5,22.6 | v75.5,32.83 75.78,32.83 76.28,32.33 76.28,31.86 75.95,31.54 72.94,31.54 64.9,23.49 64.9,22.64 | v38.3,25.6 38.3,26.2 v37.2,27.3 35.69,25.79 35.69,17.99 v35.4,17.7 | v23.8,5 24.6,5.8 v35.6,5.8 35.6,11.6 v35.3,11.9 | v66.7,21.5 65.56,22.64 64.9,22.64 | 64.9,22.64 60.5,22.64
  Route15 0.2: v45.7,90.4 v45.7,87.6 | v45.7,87.6 v45.7,84.8 45.1,84.2 43.1,84.2 | 43.1,84.2 v43.1,82.1 43.1,80 46.2,76.9 v46.2,72.6 46.2,71.8 | 43.1,84.2 v42.4,84.9 v42.4,87.7 v42.4,90.5 | 46.2,71.8 v46.2,69.8 v46.2,67 v46.2,64.2 46.14,64.14 v46.14,61.36 46.14,58.66 v46.2,58.6 | v49.5,67 v49.5,64.2 49.46,64.16 v49.46,61.75 49.46,58.64 v49.5,58.6 49.5,56.6 v50.6,55.5 51.77,54.32 v51.77,54.1 | v49.5,67 v49.5,69.8 49.5,71.8 | 49.5,71.8 v49.5,72.6 | 46.2,71.8 49.5,71.8 | v54,87.8 53.8,87.6 v45.7,87.6 | 56.6,66.6 v57.2,67.2 60.69,70.69 v63.58,70.69 | 56.6,66.6 49.9,66.6 v49.5,67 | v57.2,60 56.6,60.6 56.6,66.6 | v84,83.5 87.7,79.8 v87.7,79 87.7,70.46 v87.96,70.2
  Bottom 0.2: U51.3 42.35,90.45 v42.4,90.5 | U48.3 42.35,87.65 v42.4,87.7 | U46.3 42.35,84.85 v42.4,84.9 | U44.3 43.05,82.05 v43.1,82.1 43.1,81.98 43.64,81.44 45.14,81.44 U43.3 | U45.3 45.65,84.85 v45.7,84.8 | U47.3 45.65,87.65 v45.7,87.6 | U50.3 45.65,90.45 v45.7,90.4 | U39.3 46.15,72.55 v46.2,72.6 | U37.3 46.15,69.75 v46.2,69.8 | U33.3 46.15,66.95 v46.2,67 | U30.3 46.15,64.15 v46.2,64.2 | U38.3 49.45,72.55 v49.5,72.6 | U36.3 49.45,69.75 v49.5,69.8 | U32.3 49.45,66.95 v49.5,67 | U29.3 49.45,64.15 v49.5,64.2 | v46.14,61.36 U28.3 | U25.3 46.15,58.55 v46.2,58.6 | U24.3 49.45,58.55 v49.5,58.6 | U27.3 49.15,61.35 49.46,61.66 v49.46,61.75 | U49.10 52.9,88.1 53.15,88.35 C96.1 53.45,88.35 v54,87.8 | U35.10 56.1,67.5 56.35,67.75 C72.1 56.65,67.75 v57.2,67.2 | U26.10 56.1,60.3 56.35,60.55 C59.1 56.65,60.55 v57.2,60 | v84,83.5 84.5,83.5 84.8,83.2 C86.1 84.75,82.8 U42.1 83.1,83.3 82.7,83.7 U42.20 | U40.3 C81.1 87.65,78.95 v87.7,79 | U34.3 87.05,70.1 C74.1 v87.96,70.2 87.96,68.06 88.88,67.14 88.88,65.6 88.34,65.07 83.17,65.07 v82.04,63.94 81.24,63.14 81.24,62.36 82.74,60.86 83.33,60.86 83.66,60.53 83.66,60.06 83.25,59.65 80.77,59.65 77.9,56.78 74.48,56.78 70.63,52.92 70.63,47.31 71.76,46.18 72.62,46.18 73.32,45.48 73.32,45.11 75.63,42.8 v75.63,42.52 v75.64,42.52 75.64,41.57 72.81,38.74 72.81,35.23 75.22,32.83 v75.5,32.83 | U41.13 63.65,70.75 v63.58,70.69 | U23.3 50.55,55.55 v50.6,55.5 | v81.25,64.73 81.25,65.35 79.9,66.7 78.61,66.7 78.25,66.34 U31.3 | v51.77,54.1 52.76,54.1 58,48.86 58,42.99 55.76,40.75 55.76,32.73 57.84,30.65 | C27.1 83.45,29.95 | 83.45,29.95 83.1,29.95 82.85,30.2 U11.1 82.1,30.8 81.8,31.1 U11.20